# Altium project FlightController.PrjPcb (part 1 of 2)
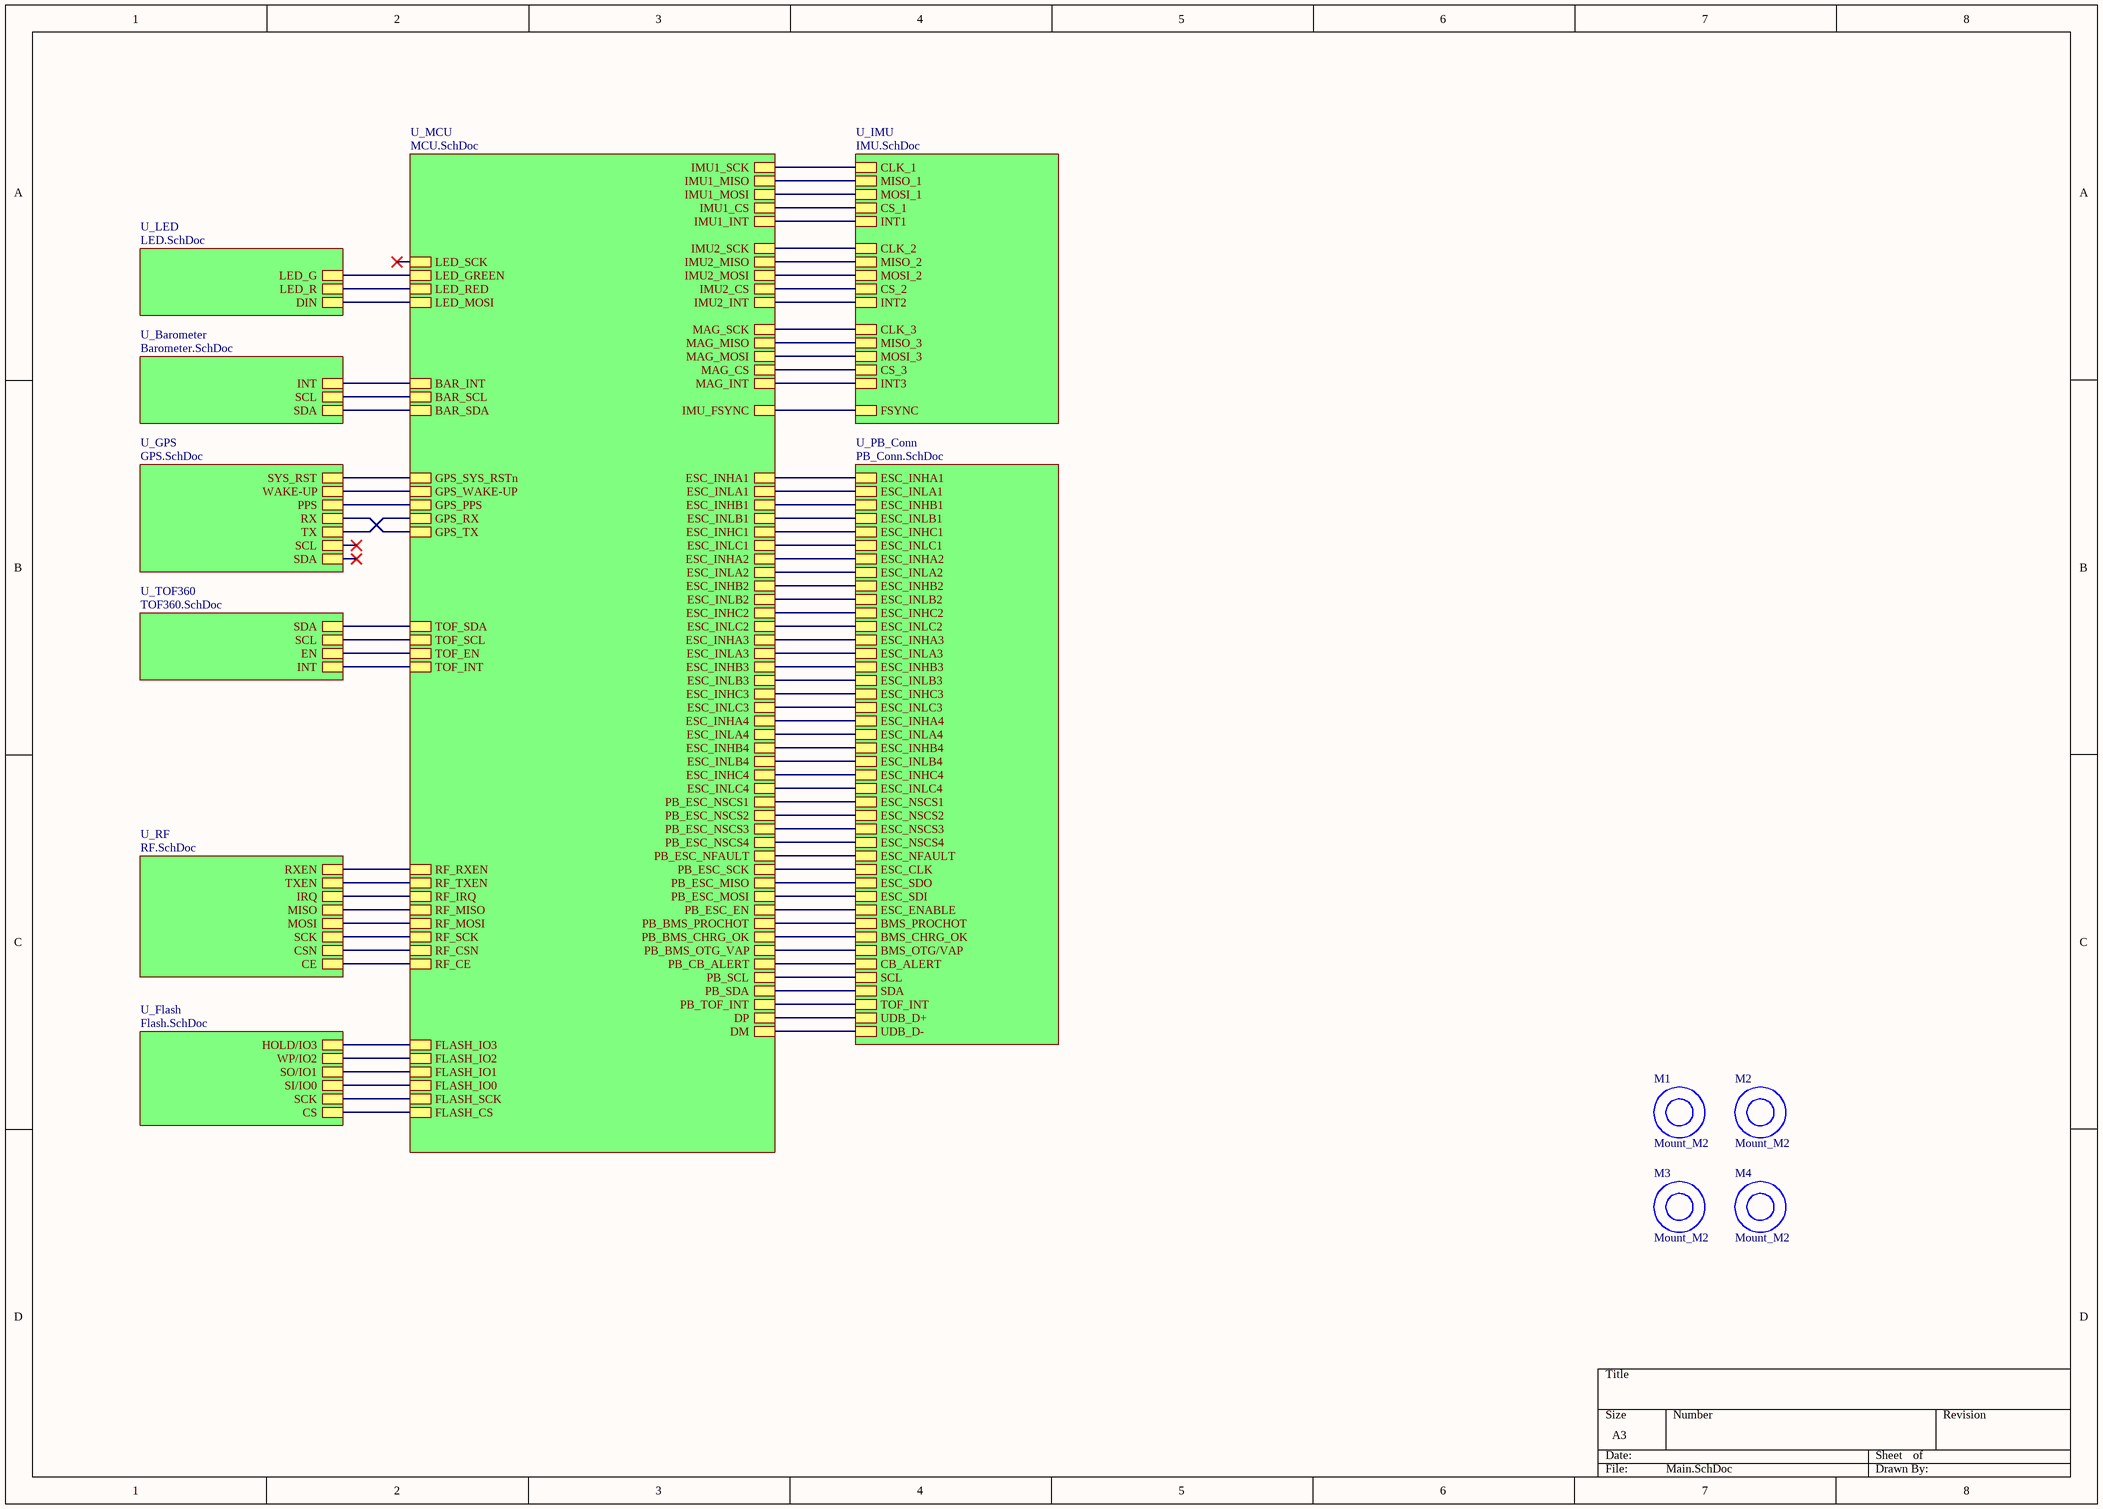
[diagram p0: Main.SchDoc]
12 sheets, 184 parts. Net scope: hierarchical (ports join the sheet entries above them; power ports are global).
Board file: PCB.PcbDoc
Sheets:
  Main.SchDoc
    U_MCU = MCU.SchDoc
    U_TOF360 = TOF360.SchDoc
    U_IMU = IMU.SchDoc
    U_RF = RF.SchDoc
      U_NRF24l01 = NRF24l01.SchDoc
    U_Flash = Flash.SchDoc
    U_GPS = GPS.SchDoc
    U_Barometer = Barometer.SchDoc
    U_LED = LED.SchDoc
    U_PB_Conn = PB_Conn.SchDoc
      U_PSU = PSU.SchDoc

## Sheet Main.SchDoc
size A3; SheetNumber: 1; SheetTotal: 12

### Parts
M1  Mount_M2  [Mount_M2]
M2  Mount_M2  [Mount_M2]
M3  Mount_M2  [Mount_M2]
M4  Mount_M2  [Mount_M2]

### Sub-sheets
U_Barometer = Barometer.SchDoc: SDA, SCL, INT
U_Flash = Flash.SchDoc: CS, SO/IO1, WP/IO2, HOLD/IO3, SCK, SI/IO0
U_GPS = GPS.SchDoc: SDA, SCL, TX, RX, PPS, WAKE-UP, SYS_RST
U_IMU = IMU.SchDoc: INT1, INT2, MISO_1, MOSI_1, CS_1, CLK_1, FSYNC, MISO_2, MOSI_2, CS_2, CLK_2, MOSI_3, CS_3, CLK_3, MISO_3, INT3
U_LED = LED.SchDoc: DIN, LED_R, LED_G
U_MCU = MCU.SchDoc: DP, DM, TOF_SDA, TOF_SCL, TOF_EN, TOF_INT, ESC_INHA1, ESC_INHA2, ESC_INHA3, ESC_INHA4, ESC_INHB1, ESC_INHC1, ESC_INHB2, ESC_INHB3, ESC_INHB4, ESC_INHC2, ESC_INHC3, ESC_INHC4, ESC_INLA1, ESC_INLB1, ESC_INLC1, ESC_INLA2, ESC_INLA3, ESC_INLA4, ESC_INLB2, ESC_INLB3, ESC_INLB4, ESC_INLC2, ESC_INLC3, ESC_INLC4, RF_IRQ, RF_CSN, RF_MOSI, RF_MISO, RF_SCK, RF_CE, RF_RXEN, RF_TXEN, PB_SCL, PB_SDA, PB_TOF_INT, PB_ESC_EN, PB_ESC_SCK, PB_ESC_MISO, PB_ESC_MOSI, PB_ESC_NSCS1, PB_ESC_NSCS2, PB_ESC_NSCS3, PB_ESC_NSCS4, PB_BMS_PROCHOT, PB_BMS_OTG_VAP, PB_BMS_CHRG_OK, PB_CB_ALERT, PB_ESC_NFAULT, FLASH_IO0, FLASH_IO1, FLASH_IO2, FLASH_IO3, FLASH_SCK, FLASH_CS, GPS_RX, GPS_TX, GPS_PPS, GPS_WAKE-UP, GPS_SYS_RSTn, BAR_SCL, BAR_SDA, BAR_INT, LED_MOSI, LED_SCK, LED_RED, LED_GREEN, IMU1_SCK, IMU1_MISO, IMU1_MOSI, IMU1_CS, IMU1_INT, IMU2_INT, IMU2_SCK, IMU2_MISO, IMU2_MOSI, IMU2_CS, MAG_SCK, MAG_MISO, MAG_MOSI, MAG_CS, MAG_INT, IMU_FSYNC
U_PB_Conn = PB_Conn.SchDoc: ESC_INLA1, ESC_INLB1, ESC_INLC1, ESC_INLA2, ESC_INLB2, ESC_INLC2, ESC_INLA3, ESC_INLB3, ESC_INLC3, ESC_INHA4, ESC_INLB4, ESC_INLC4, ESC_NSCS1, ESC_INHA1, ESC_INHB1, ESC_INHC1, ESC_INHA2, ESC_INHB2, ESC_INHC2, ESC_INHA3, ESC_INHB3, ESC_INHC3, ESC_INLA4, ESC_INHB4, ESC_INHC4, ESC_NSCS2, ESC_NSCS3, ESC_NSCS4, ESC_NFAULT, ESC_CLK, ESC_SDO, ESC_SDI, ESC_ENABLE, BMS_PROCHOT, BMS_CHRG_OK, BMS_OTG/VAP, CB_ALERT, SCL, SDA, TOF_INT, UDB_D+, UDB_D-
U_RF = RF.SchDoc: CE, CSN, SCK, MOSI, MISO, IRQ, TXEN, RXEN
U_TOF360 = TOF360.SchDoc: INT, SCL, SDA, EN

### Nets
BMS_CHRG_OK: sheet U_MCU/PB_BMS_CHRG_OK, sheet U_PB_Conn/BMS_CHRG_OK
BMS_OTG/VAP: sheet U_MCU/PB_BMS_OTG_VAP, sheet U_PB_Conn/BMS_OTG/VAP
BMS_PROCHOT: sheet U_MCU/PB_BMS_PROCHOT, sheet U_PB_Conn/BMS_PROCHOT
CB_ALERT: sheet U_MCU/PB_CB_ALERT, sheet U_PB_Conn/CB_ALERT
ESC_CLK: sheet U_MCU/PB_ESC_SCK, sheet U_PB_Conn/ESC_CLK
ESC_ENABLE: sheet U_MCU/PB_ESC_EN, sheet U_PB_Conn/ESC_ENABLE
ESC_INHA1: sheet U_MCU/ESC_INHA1, sheet U_PB_Conn/ESC_INHA1
ESC_INHA2: sheet U_MCU/ESC_INHA2, sheet U_PB_Conn/ESC_INHA2
ESC_INHA3: sheet U_MCU/ESC_INHA3, sheet U_PB_Conn/ESC_INHA3
ESC_INHA4: sheet U_MCU/ESC_INHA4, sheet U_PB_Conn/ESC_INHA4
ESC_INHB1: sheet U_MCU/ESC_INHB1, sheet U_PB_Conn/ESC_INHB1
ESC_INHB2: sheet U_MCU/ESC_INHB2, sheet U_PB_Conn/ESC_INHB2
ESC_INHB3: sheet U_MCU/ESC_INHB3, sheet U_PB_Conn/ESC_INHB3
ESC_INHB4: sheet U_MCU/ESC_INHB4, sheet U_PB_Conn/ESC_INHB4
ESC_INHC1: sheet U_MCU/ESC_INHC1, sheet U_PB_Conn/ESC_INHC1
ESC_INHC2: sheet U_MCU/ESC_INHC2, sheet U_PB_Conn/ESC_INHC2
ESC_INHC3: sheet U_MCU/ESC_INHC3, sheet U_PB_Conn/ESC_INHC3
ESC_INHC4: sheet U_MCU/ESC_INHC4, sheet U_PB_Conn/ESC_INHC4
ESC_INLA1: sheet U_MCU/ESC_INLA1, sheet U_PB_Conn/ESC_INLA1
ESC_INLA2: sheet U_MCU/ESC_INLA2, sheet U_PB_Conn/ESC_INLA2
ESC_INLA3: sheet U_MCU/ESC_INLA3, sheet U_PB_Conn/ESC_INLA3
ESC_INLA4: sheet U_MCU/ESC_INLA4, sheet U_PB_Conn/ESC_INLA4
ESC_INLB1: sheet U_MCU/ESC_INLB1, sheet U_PB_Conn/ESC_INLB1
ESC_INLB2: sheet U_MCU/ESC_INLB2, sheet U_PB_Conn/ESC_INLB2
ESC_INLB3: sheet U_MCU/ESC_INLB3, sheet U_PB_Conn/ESC_INLB3
ESC_INLB4: sheet U_MCU/ESC_INLB4, sheet U_PB_Conn/ESC_INLB4
ESC_INLC1: sheet U_MCU/ESC_INLC1, sheet U_PB_Conn/ESC_INLC1
ESC_INLC2: sheet U_MCU/ESC_INLC2, sheet U_PB_Conn/ESC_INLC2
ESC_INLC3: sheet U_MCU/ESC_INLC3, sheet U_PB_Conn/ESC_INLC3
ESC_INLC4: sheet U_MCU/ESC_INLC4, sheet U_PB_Conn/ESC_INLC4
ESC_NFAULT: sheet U_MCU/PB_ESC_NFAULT, sheet U_PB_Conn/ESC_NFAULT
ESC_NSCS1: sheet U_MCU/PB_ESC_NSCS1, sheet U_PB_Conn/ESC_NSCS1
ESC_NSCS2: sheet U_MCU/PB_ESC_NSCS2, sheet U_PB_Conn/ESC_NSCS2
ESC_NSCS3: sheet U_MCU/PB_ESC_NSCS3, sheet U_PB_Conn/ESC_NSCS3
ESC_NSCS4: sheet U_MCU/PB_ESC_NSCS4, sheet U_PB_Conn/ESC_NSCS4
ESC_SDI: sheet U_MCU/PB_ESC_MOSI, sheet U_PB_Conn/ESC_SDI
ESC_SDO: sheet U_MCU/PB_ESC_MISO, sheet U_PB_Conn/ESC_SDO
I2C1_SCL: sheet U_MCU/TOF_SCL, sheet U_TOF360/SCL
I2C1_SDA: sheet U_MCU/TOF_SDA, sheet U_TOF360/SDA
SCL: sheet U_MCU/PB_SCL, sheet U_PB_Conn/SCL
SDA: sheet U_MCU/PB_SDA, sheet U_PB_Conn/SDA
SPI1_MISO: sheet U_MCU/IMU1_MISO, sheet U_IMU/MISO_1
SPI1_MOSI: sheet U_MCU/IMU1_MOSI, sheet U_IMU/MOSI_1
SPI1_SCK: sheet U_MCU/IMU1_SCK, sheet U_IMU/CLK_1
SPI5_MISO: sheet U_MCU/MAG_MISO, sheet U_IMU/MISO_3
SPI5_MOSI: sheet U_MCU/MAG_MOSI, sheet U_IMU/MOSI_3
SPI5_SCK: sheet U_MCU/MAG_SCK, sheet U_IMU/CLK_3
SPI6_MISO: sheet U_MCU/IMU2_MISO, sheet U_IMU/MISO_2
SPI6_MOSI: sheet U_MCU/IMU2_MOSI, sheet U_IMU/MOSI_2
SPI6_SCK: sheet U_MCU/IMU2_SCK, sheet U_IMU/CLK_2
TOF_EN: sheet U_MCU/TOF_EN, sheet U_TOF360/EN
TOF_INT: sheet U_MCU/PB_TOF_INT, sheet U_PB_Conn/TOF_INT
TOF_INT: sheet U_MCU/TOF_INT, sheet U_TOF360/INT  [a separate net that carries the same name]
UDB_D+: sheet U_MCU/DP, sheet U_PB_Conn/UDB_D+
UDB_D-: sheet U_MCU/DM, sheet U_PB_Conn/UDB_D-
NetC86_2: sheet U_MCU/GPS_TX, sheet U_GPS/RX
NetC87_2: sheet U_MCU/GPS_RX, sheet U_GPS/TX
NetC88_2: sheet U_MCU/GPS_PPS, sheet U_GPS/PPS
NetIC1_5: sheet U_MCU/IMU1_CS, sheet U_IMU/CS_1
NetIC1_6: sheet U_MCU/IMU1_INT, sheet U_IMU/INT1
NetIC1_8: sheet U_MCU/IMU_FSYNC, sheet U_IMU/FSYNC
NetIC2_4: sheet U_MCU/IMU2_INT, sheet U_IMU/INT2
NetIC2_12: sheet U_MCU/IMU2_CS, sheet U_IMU/CS_2
NetIC3_1: sheet U_MCU/MAG_INT, sheet U_IMU/INT3
NetIC3_2: sheet U_MCU/MAG_CS, sheet U_IMU/CS_3
NetIC4_5: sheet U_MCU/LED_MOSI, sheet U_LED/DIN
NetIC4_26: sheet U_MCU/LED_GREEN, sheet U_LED/LED_G
NetIC4_27: sheet U_MCU/LED_RED, sheet U_LED/LED_R
NetIC4_42: sheet U_MCU/FLASH_IO3, sheet U_Flash/HOLD/IO3
NetIC4_43: sheet U_MCU/FLASH_IO2, sheet U_Flash/WP/IO2
NetIC4_46: sheet U_MCU/FLASH_IO1, sheet U_Flash/SO/IO1
NetIC4_47: sheet U_MCU/FLASH_IO0, sheet U_Flash/SI/IO0
NetIC4_48: sheet U_MCU/FLASH_SCK, sheet U_Flash/SCK
NetIC4_53: sheet U_MCU/BAR_INT, sheet U_Barometer/INT
NetIC4_54: sheet U_MCU/BAR_SCL, sheet U_Barometer/SCL
NetIC4_55: sheet U_MCU/BAR_SDA, sheet U_Barometer/SDA
NetIC4_64: sheet U_MCU/FLASH_CS, sheet U_Flash/CS
NetIC4_91: sheet U_MCU/GPS_SYS_RSTn, sheet U_GPS/SYS_RST
NetIC4_100: sheet U_MCU/GPS_WAKE-UP, sheet U_GPS/WAKE-UP
NetIC4_110: sheet U_MCU/RF_CE, sheet U_RF/CE
NetIC4_111: sheet U_MCU/RF_SCK, sheet U_RF/SCK
NetIC4_112: sheet U_MCU/RF_MISO, sheet U_RF/MISO
NetIC4_113: sheet U_MCU/RF_MOSI, sheet U_RF/MOSI
NetIC4_114: sheet U_MCU/RF_CSN, sheet U_RF/CSN
NetIC4_115: sheet U_MCU/RF_IRQ, sheet U_RF/IRQ
NetIC4_116: sheet U_MCU/RF_TXEN, sheet U_RF/TXEN
NetIC4_117: sheet U_MCU/RF_RXEN, sheet U_RF/RXEN

## Sheet MCU.SchDoc
size A2; SheetNumber: 3; SheetTotal: 12
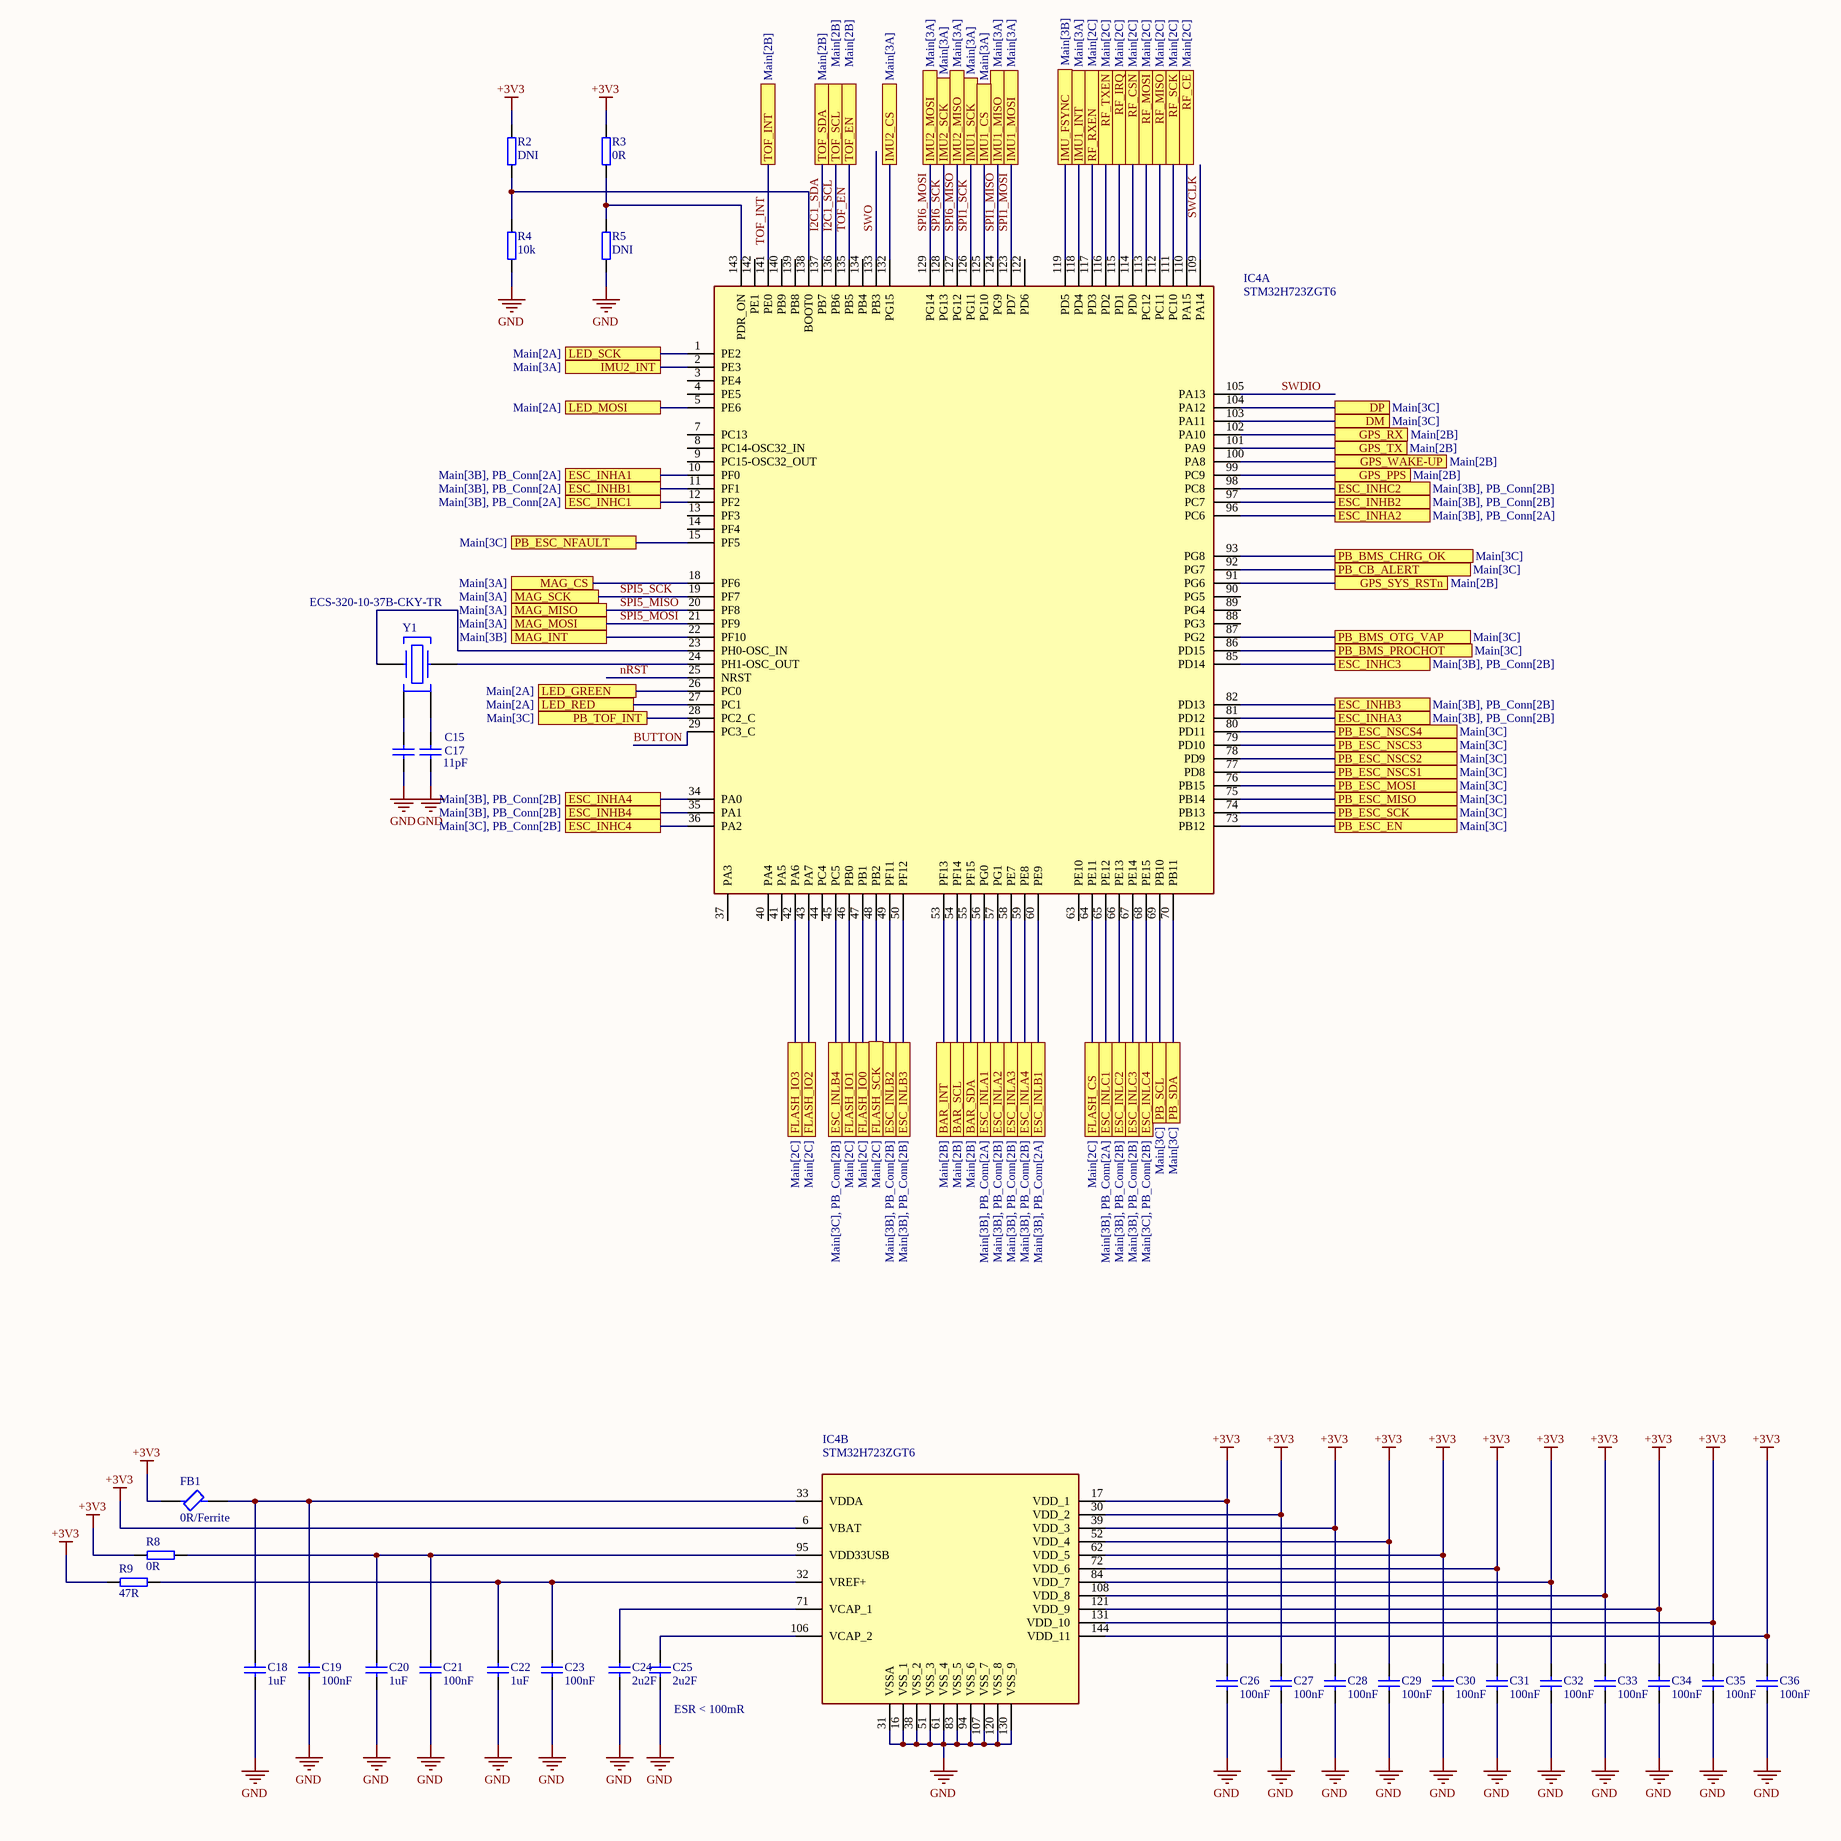
[diagram p1: MCU.SchDoc, left]
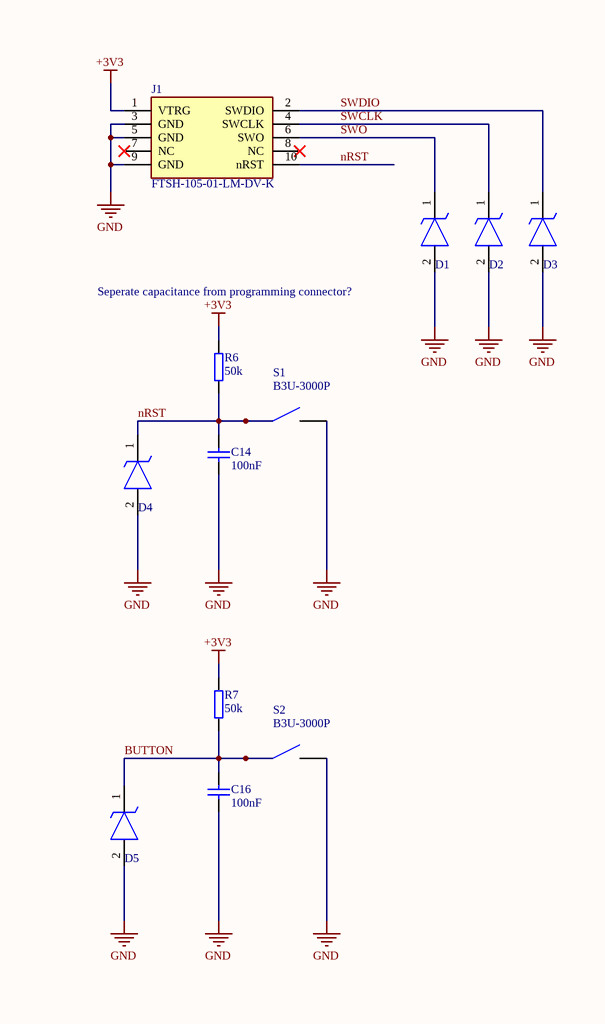
[diagram p2: MCU.SchDoc, right]

### Parts
C14  value 100nF  [CAP0402]  (hidden comment: Cap0402)
C15  Cap0402  [CAP0402]  (value not drawn)
C16  value 100nF  [CAP0402]  (hidden comment: Cap0402)
C17  value 11pF  [CAP0402]  (hidden comment: Cap0402)
C18  value 1uF  [CAP0603]  (hidden comment: Cap0603)
C19  value 100nF  [CAP0402]  (hidden comment: Cap0402)
C20  value 1uF  [CAP0603]  (hidden comment: Cap0603)
C21  value 100nF  [CAP0402]  (hidden comment: Cap0402)
C22  value 1uF  [CAP0603]  (hidden comment: Cap0603)
C23  value 100nF  [CAP0402]  (hidden comment: Cap0402)
C24  value 2u2F  [CAP0603]  (hidden comment: Cap0603)
C25  value 2u2F  [CAP0603]  (hidden comment: Cap0603)
C26  value 100nF  [CAP0402]  (hidden comment: Cap0402)
C27  value 100nF  [CAP0402]  (hidden comment: Cap0402)
C28  value 100nF  [CAP0402]  (hidden comment: Cap0402)
C29  value 100nF  [CAP0402]  (hidden comment: Cap0402)
C30  value 100nF  [CAP0402]  (hidden comment: Cap0402)
C31  value 100nF  [CAP0402]  (hidden comment: Cap0402)
C32  value 100nF  [CAP0402]  (hidden comment: Cap0402)
C33  value 100nF  [CAP0402]  (hidden comment: Cap0402)
C34  value 100nF  [CAP0402]  (hidden comment: Cap0402)
C35  value 100nF  [CAP0402]  (hidden comment: Cap0402)
C36  value 100nF  [CAP0402]  (hidden comment: Cap0402)
D1  D1213A-01LP4-7B  [D1213A01LP47B]  (value not drawn)
D2  D1213A-01LP4-7B  [D1213A01LP47B]  (value not drawn)
D3  D1213A-01LP4-7B  [D1213A01LP47B]  (value not drawn)
D4  D1213A-01LP4-7B  [D1213A01LP47B]  (value not drawn)
D5  D1213A-01LP4-7B  [D1213A01LP47B]  (value not drawn)
FB1  0R/Ferrite  [NFZ15SG152SN10B]
IC4  STM32H723ZGT6  [QFP50P2200X2200X160-144N]  (parts A,B of 2)
J1  FTSH-105-01-LM-DV-K  [FTSH-105-XX-YYY-DV-K]
R2  value DNI  [RES0402]  (hidden comment: Res0402)
R3  value 0R  [RES0402]  (hidden comment: Res0402)
R4  value 10k  [RES0402]  (hidden comment: Res0402)
R5  value DNI  [RES0402]  (hidden comment: Res0402)
R6  value 50k  [RES0402]  (hidden comment: Res0402)
R7  value 50k  [RES0402]  (hidden comment: Res0402)
R8  value 0R  [RES0402]  (hidden comment: Res0402)
R9  value 47R  [RES0402]  (hidden comment: Res0402)
S1  B3U-3000P  [B3U-1000P]
S2  B3U-3000P  [B3U-1000P]
Y1  ECS-320-10-37B-CKY-TR  [ECS3201037BCKYTR]

### Ports
BAR_INT (see Main[2B]), BAR_SCL (see Main[2B]), BAR_SDA (see Main[2B]), DM (see Main[3C]), DP (see Main[3C]), ESC_INHA1 (see Main[3B], PB_Conn[2A]), ESC_INHA2 (see Main[3B], PB_Conn[2A]), ESC_INHA3 (see Main[3B], PB_Conn[2B]), ESC_INHA4 (see Main[3B], PB_Conn[2B]), ESC_INHB1 (see Main[3B], PB_Conn[2A]), ESC_INHB2 (see Main[3B], PB_Conn[2B]), ESC_INHB3 (see Main[3B], PB_Conn[2B]), ESC_INHB4 (see Main[3B], PB_Conn[2B]), ESC_INHC1 (see Main[3B], PB_Conn[2A]), ESC_INHC2 (see Main[3B], PB_Conn[2B]), ESC_INHC3 (see Main[3B], PB_Conn[2B]), ESC_INHC4 (see Main[3C], PB_Conn[2B]), ESC_INLA1 (see Main[3B], PB_Conn[2A]), ESC_INLA2 (see Main[3B], PB_Conn[2B]), ESC_INLA3 (see Main[3B], PB_Conn[2B]), ESC_INLA4 (see Main[3B], PB_Conn[2B]), ESC_INLB1 (see Main[3B], PB_Conn[2A]), ESC_INLB2 (see Main[3B], PB_Conn[2B]), ESC_INLB3 (see Main[3B], PB_Conn[2B]), ESC_INLB4 (see Main[3C], PB_Conn[2B]), ESC_INLC1 (see Main[3B], PB_Conn[2A]), ESC_INLC2 (see Main[3B], PB_Conn[2B]), ESC_INLC3 (see Main[3B], PB_Conn[2B]), ESC_INLC4 (see Main[3C], PB_Conn[2B]), FLASH_CS (see Main[2C]), FLASH_IO0 (see Main[2C]), FLASH_IO1 (see Main[2C]), FLASH_IO2 (see Main[2C]), FLASH_IO3 (see Main[2C]), FLASH_SCK (see Main[2C]), GPS_PPS (see Main[2B]), GPS_RX (see Main[2B]), GPS_SYS_RSTn (see Main[2B]), GPS_TX (see Main[2B]), GPS_WAKE-UP (see Main[2B]), IMU1_CS (see Main[3A]), IMU1_INT (see Main[3A]), IMU1_MISO (see Main[3A]), IMU1_MOSI (see Main[3A]), IMU1_SCK (see Main[3A]), IMU2_CS (see Main[3A]), IMU2_INT (see Main[3A]), IMU2_MISO (see Main[3A]), IMU2_MOSI (see Main[3A]), IMU2_SCK (see Main[3A]), IMU_FSYNC (see Main[3B]), LED_GREEN (see Main[2A]), LED_MOSI (see Main[2A]), LED_RED (see Main[2A]), LED_SCK (see Main[2A]), MAG_CS (see Main[3A]), MAG_INT (see Main[3B]), MAG_MISO (see Main[3A]), MAG_MOSI (see Main[3A]), MAG_SCK (see Main[3A]), PB_BMS_CHRG_OK (see Main[3C]), PB_BMS_OTG_VAP (see Main[3C]), PB_BMS_PROCHOT (see Main[3C]), PB_CB_ALERT (see Main[3C]), PB_ESC_EN (see Main[3C]), PB_ESC_MISO (see Main[3C]), PB_ESC_MOSI (see Main[3C]), PB_ESC_NFAULT (see Main[3C]), PB_ESC_NSCS1 (see Main[3C]), PB_ESC_NSCS2 (see Main[3C]), PB_ESC_NSCS3 (see Main[3C]), PB_ESC_NSCS4 (see Main[3C]), PB_ESC_SCK (see Main[3C]), PB_SCL (see Main[3C]), PB_SDA (see Main[3C]), PB_TOF_INT (see Main[3C]), RF_CE (see Main[2C]), RF_CSN (see Main[2C]), RF_IRQ (see Main[2C]), RF_MISO (see Main[2C]), RF_MOSI (see Main[2C]), RF_RXEN (see Main[2C]), RF_SCK (see Main[2C]), RF_TXEN (see Main[2C]), TOF_EN (see Main[2B]), TOF_INT (see Main[2B]), TOF_SCL (see Main[2B]), TOF_SDA (see Main[2B])

### Nets
+3V3: C26.2 C27.2 C28.2 C29.2 C30.2 C31.2 C32.2 C33.2 C34.2 C35.2 C36.2 FB1.1 IC4.6(VBAT) IC4.17(VDD_1) IC4.30(VDD_2) IC4.39(VDD_3) IC4.52(VDD_4) IC4.62(VDD_5) IC4.72(VDD_6) IC4.84(VDD_7) IC4.108(VDD_8) IC4.121(VDD_9) IC4.131(VDD_10) IC4.144(VDD_11) J1.1(VTRG) R2.2 R3.2 R6.2 R7.2 R8.1 R9.1
GND: C14.1 C15.1 C16.1 C17.1 C18.1 C19.1 C20.1 C21.1 C22.1 C23.1 C24.1 C25.1 C26.1 C27.1 C28.1 C29.1 C30.1 C31.1 C32.1 C33.1 C34.1 C35.1 C36.1 D1.2(A) D2.2(A) D3.2(A) D4.2(A) D5.2(A) IC4.16(VSS_1) IC4.31(VSSA) IC4.38(VSS_2) IC4.51(VSS_3) IC4.61(VSS_4) IC4.83(VSS_5) IC4.94(VSS_6) IC4.107(VSS_7) IC4.120(VSS_8) IC4.130(VSS_9) J1.3(GND) J1.5(GND) J1.9(GND) R4.1 R5.1 S1.1 S2.1
BMS_CHRG_OK: IC4.93(PG8) ; port PB_BMS_CHRG_OK
BMS_OTG/VAP: IC4.87(PG2) ; port PB_BMS_OTG_VAP
BMS_PROCHOT: IC4.86(PD15) ; port PB_BMS_PROCHOT
BUTTON: C16.2 D5.1(K) IC4.29(PC3_C) R7.1 S2.2
CB_ALERT: IC4.92(PG7) ; port PB_CB_ALERT
ESC_CLK: IC4.74(PB13) ; port PB_ESC_SCK
ESC_ENABLE: IC4.73(PB12) ; port PB_ESC_EN
ESC_INHA1: IC4.10(PF0) ; port ESC_INHA1
ESC_INHA2: IC4.96(PC6) ; port ESC_INHA2
ESC_INHA3: IC4.81(PD12) ; port ESC_INHA3
ESC_INHA4: IC4.34(PA0) ; port ESC_INHA4
ESC_INHB1: IC4.11(PF1) ; port ESC_INHB1
ESC_INHB2: IC4.97(PC7) ; port ESC_INHB2
ESC_INHB3: IC4.82(PD13) ; port ESC_INHB3
ESC_INHB4: IC4.35(PA1) ; port ESC_INHB4
ESC_INHC1: IC4.12(PF2) ; port ESC_INHC1
ESC_INHC2: IC4.98(PC8) ; port ESC_INHC2
ESC_INHC3: IC4.85(PD14) ; port ESC_INHC3
ESC_INHC4: IC4.36(PA2) ; port ESC_INHC4
ESC_INLA1: IC4.56(PG0) ; port ESC_INLA1
ESC_INLA2: IC4.57(PG1) ; port ESC_INLA2
ESC_INLA3: IC4.58(PE7) ; port ESC_INLA3
ESC_INLA4: IC4.59(PE8) ; port ESC_INLA4
ESC_INLB1: IC4.60(PE9) ; port ESC_INLB1
ESC_INLB2: IC4.49(PF11) ; port ESC_INLB2
ESC_INLB3: IC4.50(PF12) ; port ESC_INLB3
ESC_INLB4: IC4.45(PC5) ; port ESC_INLB4
ESC_INLC1: IC4.65(PE12) ; port ESC_INLC1
ESC_INLC2: IC4.66(PE13) ; port ESC_INLC2
ESC_INLC3: IC4.67(PE14) ; port ESC_INLC3
ESC_INLC4: IC4.68(PE15) ; port ESC_INLC4
ESC_NFAULT: IC4.15(PF5) ; port PB_ESC_NFAULT
ESC_NSCS1: IC4.77(PD8) ; port PB_ESC_NSCS1
ESC_NSCS2: IC4.78(PD9) ; port PB_ESC_NSCS2
ESC_NSCS3: IC4.79(PD10) ; port PB_ESC_NSCS3
ESC_NSCS4: IC4.80(PD11) ; port PB_ESC_NSCS4
ESC_SDI: IC4.76(PB15) ; port PB_ESC_MOSI
ESC_SDO: IC4.75(PB14) ; port PB_ESC_MISO
I2C1_SCL: IC4.136(PB6) ; port TOF_SCL
I2C1_SDA: IC4.137(PB7) ; port TOF_SDA
nRST: C14.2 D4.1(K) IC4.25(NRST) J1.10(nRST) R6.1 S1.2
SCL: IC4.69(PB10) ; port PB_SCL
SDA: IC4.70(PB11) ; port PB_SDA
SPI1_MISO: IC4.124(PG9) ; port IMU1_MISO
SPI1_MOSI: IC4.123(PD7) ; port IMU1_MOSI
SPI1_SCK: IC4.126(PG11) ; port IMU1_SCK
SPI5_MISO: IC4.20(PF8) ; port MAG_MISO
SPI5_MOSI: IC4.21(PF9) ; port MAG_MOSI
SPI5_SCK: IC4.19(PF7) ; port MAG_SCK
SPI6_MISO: IC4.127(PG12) ; port IMU2_MISO
SPI6_MOSI: IC4.129(PG14) ; port IMU2_MOSI
SPI6_SCK: IC4.128(PG13) ; port IMU2_SCK
SWCLK: D2.1(K) IC4.109(PA14) J1.4(SWCLK)
SWDIO: D3.1(K) IC4.105(PA13) J1.2(SWDIO)
SWO: D1.1(K) IC4.133(PB3) J1.6(SWO)
TOF_EN: IC4.135(PB5) ; port TOF_EN
TOF_INT: IC4.28(PC2_C) ; port PB_TOF_INT
TOF_INT: IC4.141(PE0) ; port TOF_INT  [a separate net that carries the same name]
UDB_D+: IC4.104(PA12) ; port DP
UDB_D-: IC4.103(PA11) ; port DM
NetC15_2: C15.2 Y1.4(GND_2)
NetC17_2: C17.2 Y1.2(GND_1)
NetC18_2: C18.2 C19.2 FB1.2 IC4.33(VDDA)
NetC20_2: C20.2 C21.2 IC4.95(VDD33USB) R8.2
NetC22_2: C22.2 C23.2 IC4.32(VREF+) R9.2
NetC24_2: C24.2 IC4.71(VCAP_1)
NetC25_2: C25.2 IC4.106(VCAP_2)
NetC86_2: IC4.101(PA9) ; port GPS_TX
NetC87_2: IC4.102(PA10) ; port GPS_RX
NetC88_2: IC4.99(PC9) ; port GPS_PPS
NetIC1_5: IC4.125(PG10) ; port IMU1_CS
NetIC1_6: IC4.118(PD4) ; port IMU1_INT
NetIC1_8: IC4.119(PD5) ; port IMU_FSYNC
NetIC2_4: IC4.2(PE3) ; port IMU2_INT
NetIC2_12: IC4.132(PG15) ; port IMU2_CS
NetIC3_1: IC4.22(PF10) ; port MAG_INT
NetIC3_2: IC4.18(PF6) ; port MAG_CS
NetIC4_1: IC4.1(PE2) ; port LED_SCK
NetIC4_5: IC4.5(PE6) ; port LED_MOSI
NetIC4_23: IC4.23(PH0-OSC_IN) Y1.1(CRYSTAL_1)
NetIC4_24: IC4.24(PH1-OSC_OUT) Y1.3(CRYSTAL_2)
NetIC4_26: IC4.26(PC0) ; port LED_GREEN
NetIC4_27: IC4.27(PC1) ; port LED_RED
NetIC4_42: IC4.42(PA6) ; port FLASH_IO3
NetIC4_43: IC4.43(PA7) ; port FLASH_IO2
NetIC4_46: IC4.46(PB0) ; port FLASH_IO1
NetIC4_47: IC4.47(PB1) ; port FLASH_IO0
NetIC4_48: IC4.48(PB2) ; port FLASH_SCK
NetIC4_53: IC4.53(PF13) ; port BAR_INT
NetIC4_54: IC4.54(PF14) ; port BAR_SCL
NetIC4_55: IC4.55(PF15) ; port BAR_SDA
NetIC4_64: IC4.64(PE11) ; port FLASH_CS
NetIC4_91: IC4.91(PG6) ; port GPS_SYS_RSTn
NetIC4_100: IC4.100(PA8) ; port GPS_WAKE-UP
NetIC4_110: IC4.110(PA15) ; port RF_CE
NetIC4_111: IC4.111(PC10) ; port RF_SCK
NetIC4_112: IC4.112(PC11) ; port RF_MISO
NetIC4_113: IC4.113(PC12) ; port RF_MOSI
NetIC4_114: IC4.114(PD0) ; port RF_CSN
NetIC4_115: IC4.115(PD1) ; port RF_IRQ
NetIC4_116: IC4.116(PD2) ; port RF_TXEN
NetIC4_117: IC4.117(PD3) ; port RF_RXEN
NetIC4_138: IC4.138(BOOT0) R2.1 R4.2
NetIC4_143: IC4.143(PDR_ON) R3.1 R5.2

Not connected (* = marked no-connect by the designer): IC4 3(PE4) 4(PE5) 7(PC13) 8(PC14-OSC32_IN) 9(PC15-OSC32_OUT) 13(PF3) 14(PF4) 37(PA3) 40(PA4) 41(PA5) 44(PC4) 63(PE10) 88(PG3) 89(PG4) 90(PG5) 122(PD6) 134(PB4) 139(PB8) 140(PB9) 142(PE1); J1 7(NC)* 8(NC)*

### Notes on the sheet
- Seperate capacitance from programming connector?
- (near C25) ESR < 100mR

### Library data of the parts
C14 C16 C17 C19 C21 C23 C26-C36 = Cap0402: Voltage: 50V
C15 = Cap0402: Voltage: 50V; Value: 11pF
C18 C20 C22 C24 C25 = Cap0603: Voltage: 50V
D1-D5 = D1213A-01LP4-7B: TVS Diode (Uni-directional); Manufacturer_Name: Diodes Incorporated; Datasheet Link: https://www.diodes.com/assets/Datasheets/D1213A-01LP4.pdf; Height: 0.4mm; Manufacturer_Part_Number: D1213A-01LP4-7B; Mouser Part Number: 621-D1213A-01LP4-7B; Mouser Price/Stock: https://www.mouser.co.uk/ProductDetail/Diodes-Incorporated/D1213A-01LP4-7B?qs=gfe7vQ8txpVKfG5NOSOvfA%3D%3D; Arrow Part Number: D1213A-01LP4-7B; Arrow Price/Stock: https://www.arrow.com/en/products/d1213a-01lp4-7b/diodes-incorporated?region=europe
FB1 = BLM15PE471SH1D: Ferrite Bead; Manufacturer_Name: Murata Electronics; Datasheet Link: https://www.murata.com/en-global/products/productdetail.aspx?cate=luNoiseSupprFilteChipFerriBead&partno=BLM15PE471SH1%23; Height: 0.55mm; Manufacturer_Part_Number: BLM15PE471SH1D; Mouser Part Number: 81-BLM15PE471SH1D; Mouser Price/Stock: https://www.mouser.co.uk/ProductDetail/Murata-Electronics/BLM15PE471SH1D?qs=DRkmTr78QATAY5qAVx1hGA%3D%3D
IC4 = STM32H723ZGT6: Integrated Circuit; Manufacturer_Name: STMicroelectronics; Datasheet Link: https://www.mouser.cn/datasheet/2/389/stm32h723zg-1893346.pdf; Height: 1.6mm; Manufacturer_Part_Number: STM32H723ZGT6; Mouser Part Number: 511-STM32H723ZGT6; Mouser Price/Stock: https://www.mouser.co.uk/ProductDetail/STMicroelectronics/STM32H723ZGT6?qs=sPbYRqrBIVkPaOxQT7wG%252BA%3D%3D; Arrow Part Number: STM32H723ZGT6; Arrow Price/Stock: https://www.arrow.com/en/products/stm32h723zgt6/stmicroelectronics?region=nac
J1 = FTSH-105-01-LM-DV-K: Connector; Manufacturer_Name: SAMTEC; Datasheet Link: http://suddendocs.samtec.com/prints/ftsh-1xx-xx-xxx-dv-xxx-xxx-mkt.pdf; Manufacturer_Part_Number: FTSH-105-01-LM-DV-K; Mouser Part Number: 200-FTSH10501LMDVK; Mouser Price/Stock: https://www.mouser.co.uk/ProductDetail/Samtec/FTSH-105-01-LM-DV-K?qs=Cqqh%252BS766wkgt1n7b4Yb6g%3D%3D; Arrow Part Number: FTSH-105-01-LM-DV-K; Arrow Price/Stock: https://www.arrow.com/en/products/ftsh-105-01-lm-dv-k/samtec?utm_currency=USD&region=nac
S1 S2 = B3U-3000P: Switch; Manufacturer_Name: Omron Electronics; Datasheet Link: http://omronfs.omron.com/en_US/ecb/products/pdf/en-b3u.pdf; Manufacturer_Part_Number: B3U-3000P; Mouser Part Number: 653-B3U-3000P; Mouser Price/Stock: https://www.mouser.co.uk/ProductDetail/Omron-Electronics/B3U-3000P?qs=AO7BQMcsEu4un9I7hS23xg%3D%3D; Arrow Part Number: B3U-3000P; Arrow Price/Stock: https://www.arrow.com/en/products/b3u-3000p/omron?region=nac
Y1 = ECS-320-10-37B-CKY-TR: Crystal or Oscillator; Manufacturer_Name: ECS; Datasheet Link: https://ecsxtal.com/store/pdf/ECX-1637B.pdf; Height: 0.5mm; Manufacturer_Part_Number: ECS-320-10-37B-CKY-TR; Mouser Part Number: 520-320-10-37B-CKYT; Mouser Price/Stock: https://www.mouser.co.uk/ProductDetail/ECS/ECS-320-10-37B-CKY-TR?qs=l7cgNqFNU1gltxVt%2FwcX%252Bw%3D%3D; Arrow Part Number: ECS-320-10-37B-CKY-TR; Arrow Price/Stock: https://www.arrow.com/en/products/ecs-320-10-37b-cky-tr/ecs-international?region=nac

## Sheet TOF360.SchDoc
size 482 x 241 mm; SheetNumber: 6; SheetTotal: 12
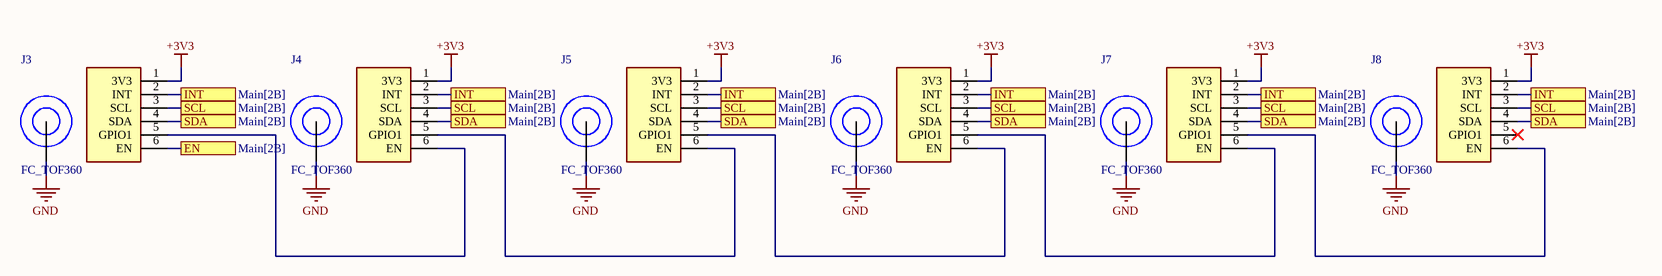
[diagram p3: TOF360.SchDoc]

### Parts
J3  FC_TOF360  [TOF_Mount]
J4  FC_TOF360  [TOF_Mount]
J5  FC_TOF360  [TOF_Mount]
J6  FC_TOF360  [TOF_Mount]
J7  FC_TOF360  [TOF_Mount]
J8  FC_TOF360  [TOF_Mount]

### Ports
EN (see Main[2B]), INT (see Main[2B]), SCL (see Main[2B]), SDA (see Main[2B])

### Nets
+3V3: J3.1(3V3) J4.1(3V3) J5.1(3V3) J6.1(3V3) J7.1(3V3) J8.1(3V3)
GND: J3.7 J4.7 J5.7 J6.7 J7.7 J8.7
I2C1_SCL: J3.3(SCL) J4.3(SCL) J5.3(SCL) J6.3(SCL) J7.3(SCL) J8.3(SCL) ; port SCL
I2C1_SDA: J3.4(SDA) J4.4(SDA) J5.4(SDA) J6.4(SDA) J7.4(SDA) J8.4(SDA) ; port SDA
TOF_EN: J3.6(EN) ; port EN
TOF_INT: J3.2(INT) J4.2(INT) J5.2(INT) J6.2(INT) J7.2(INT) J8.2(INT) ; port INT
NetJ3_5: J3.5(GPIO1) J4.6(EN)
NetJ4_5: J4.5(GPIO1) J5.6(EN)
NetJ5_5: J5.5(GPIO1) J6.6(EN)
NetJ6_5: J6.5(GPIO1) J7.6(EN)
NetJ7_5: J7.5(GPIO1) J8.6(EN)

Not connected (* = marked no-connect by the designer): J8 5(GPIO1)*

## Sheet IMU.SchDoc
size A2 portrait; SheetNumber: 3; SheetTotal: 11
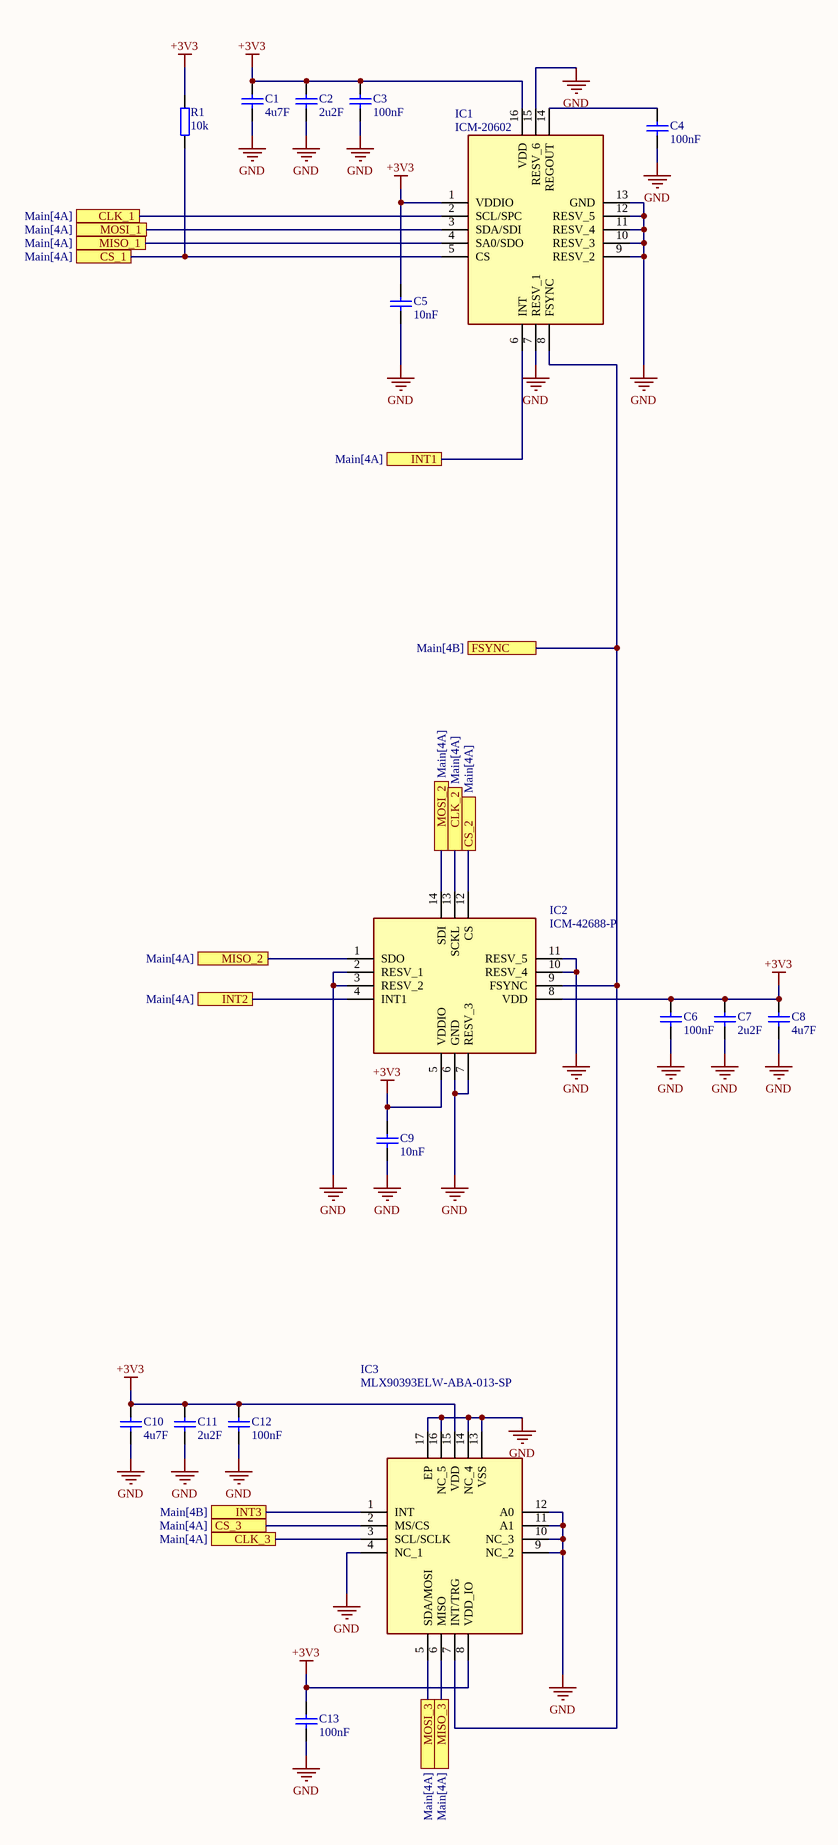
[diagram p4: IMU.SchDoc]

### Parts
C1  value 4u7F  [CAP0805]  (hidden comment: Cap0805)
C2  value 2u2F  [CAP0603]  (hidden comment: Cap0603)
C3  value 100nF  [CAP0402]  (hidden comment: Cap0402)
C4  value 100nF  [CAP0402]  (hidden comment: Cap0402)
C5  value 10nF  [CAP0402]  (hidden comment: Cap0402)
C6  value 100nF  [CAP0402]  (hidden comment: Cap0402)
C7  value 2u2F  [CAP0603]  (hidden comment: Cap0603)
C8  value 4u7F  [CAP0805]  (hidden comment: Cap0805)
C9  value 10nF  [CAP0402]  (hidden comment: Cap0402)
C10  value 4u7F  [CAP0805]  (hidden comment: Cap0805)
C11  value 2u2F  [CAP0603]  (hidden comment: Cap0603)
C12  value 100nF  [CAP0402]  (hidden comment: Cap0402)
C13  value 100nF  [CAP0402]  (hidden comment: Cap0402)
IC1  ICM-20602  [IAM20680HP]
IC2  ICM-42688-P  [IIM42352]
IC3  MLX90393ELW-ABA-013-SP  [QFN50P300X300X100-17N-D]
R1  value 10k  [RES0402]  (hidden comment: Res0402)

### Ports
CLK_1 (see Main[4A]), CLK_2 (see Main[4A]), CLK_3 (see Main[4A]), CS_1 (see Main[4A]), CS_2 (see Main[4A]), CS_3 (see Main[4A]), FSYNC (see Main[4B]), INT1 (see Main[4A]), INT2 (see Main[4A]), INT3 (see Main[4B]), MISO_1 (see Main[4A]), MISO_2 (see Main[4A]), MISO_3 (see Main[4A]), MOSI_1 (see Main[4A]), MOSI_2 (see Main[4A]), MOSI_3 (see Main[4A])

### Nets
+3V3: C1.2 C2.2 C3.2 C5.2 C6.2 C7.2 C8.2 C9.2 C10.2 C11.2 C12.2 C13.2 IC1.1(VDDIO) IC1.16(VDD) IC2.5(VDDIO) IC2.8(VDD) IC3.8(VDD_IO) IC3.15(VDD) R1.2
GND: C1.1 C2.1 C3.1 C4.1 C5.1 C6.1 C7.1 C8.1 C9.1 C10.1 C11.1 C12.1 C13.1 IC1.7(RESV_1) IC1.9(RESV_2) IC1.10(RESV_3) IC1.11(RESV_4) IC1.12(RESV_5) IC1.13(GND) IC1.15(RESV_6) IC2.2(RESV_1) IC2.3(RESV_2) IC2.6(GND) IC2.7(RESV_3) IC2.10(RESV_4) IC2.11(RESV_5) IC3.4(NC_1) IC3.9(NC_2) IC3.10(NC_3) IC3.11(A1) IC3.12(A0) IC3.13(VSS) IC3.14(NC_4) IC3.16(NC_5) IC3.17(EP)
SPI1_MISO: IC1.4(SA0/SDO) ; port MISO_1
SPI1_MOSI: IC1.3(SDA/SDI) ; port MOSI_1
SPI1_SCK: IC1.2(SCL/SPC) ; port CLK_1
SPI5_MISO: IC3.6(MISO) ; port MISO_3
SPI5_MOSI: IC3.5(SDA/MOSI) ; port MOSI_3
SPI5_SCK: IC3.3(SCL/SCLK) ; port CLK_3
SPI6_MISO: IC2.1(SDO) ; port MISO_2
SPI6_MOSI: IC2.14(SDI) ; port MOSI_2
SPI6_SCK: IC2.13(SCKL) ; port CLK_2
NetC4_2: C4.2 IC1.14(REGOUT)
NetIC1_5: IC1.5(CS) R1.1 ; port CS_1
NetIC1_6: IC1.6(INT) ; port INT1
NetIC1_8: IC1.8(FSYNC) IC2.9(FSYNC) IC3.7(INT/TRG) ; port FSYNC
NetIC2_4: IC2.4(INT1) ; port INT2
NetIC2_12: IC2.12(CS) ; port CS_2
NetIC3_1: IC3.1(INT) ; port INT3
NetIC3_2: IC3.2(MS/CS) ; port CS_3

### Library data of the parts
C1 C8 C10 = Cap0805: Voltage: 35V
C2 C7 C11 = Cap0603: Voltage: 50V
C3-C6 C9 C12 C13 = Cap0402: Voltage: 50V
IC1 = ICM-20602: Integrated Circuit; Manufacturer_Name: TDK; Datasheet Link: https://3cfeqx1hf82y3xcoull08ihx-wpengine.netdna-ssl.com/wp-content/uploads/2021/03/DS-000135-ICG-20660-TYP-v1.2.pdf; Manufacturer_Part_Number: ICM-20602; Mouser Part Number: 410-ICM-20602; Mouser Price/Stock: https://www.mouser.co.uk/ProductDetail/TDK-InvenSense/ICM-20602?qs=u4fy%2FsgLU9NtDChFbqTxBA%3D%3D; Arrow Part Number: ICM-20602; Arrow Price/Stock: https://www.arrow.com/en/products/icm-20602/invensense?utm_currency=USD&region=nac
IC2 = ICM-42688-P: Integrated Circuit; Manufacturer_Name: TDK; Datasheet Link: https://3cfeqx1hf82y3xcoull08ihx-wpengine.netdna-ssl.com/wp-content/uploads/2021/06/DS-000347-ICM-42688-P-v1.5.pdf; Manufacturer_Part_Number: ICM-42688-P; Mouser Part Number: 410-ICM-42688-P; Mouser Price/Stock: https://www.mouser.co.uk/ProductDetail/TDK-InvenSense/ICM-42688-P?qs=OlC7AqGiEDk8QrNAV728zw%3D%3D; Arrow Part Number: ICM-42688-P; Arrow Price/Stock: https://www.arrow.com/en/products/icm-42688-p/invensense?utm_currency=USD&region=nac
IC3 = MLX90393ELW-ABA-013-SP: Integrated Circuit; Manufacturer_Name: Melexis; Datasheet Link: https://www.melexis.com/-/media/files/documents/datasheets/mlx90393-datasheet-melexis.pdf; Height: 1mm; Manufacturer_Part_Number: MLX90393ELW-ABA-013-SP; Mouser Part Number: 482-90393ELWABA013SP; Mouser Price/Stock: https://www.mouser.co.uk/ProductDetail/Melexis/MLX90393ELW-ABA-013-SP?qs=4pzlT8jjbhe5W8hWOSw65g%3D%3D; Arrow Part Number: MLX90393ELW-ABA-013-SP; Arrow Price/Stock: https://www.arrow.com/en/products/mlx90393elw-aba-013-sp/melexis?utm_currency=USD&region=nac

## Sheet RF.SchDoc
size A4; SheetNumber: 5; SheetTotal: 11
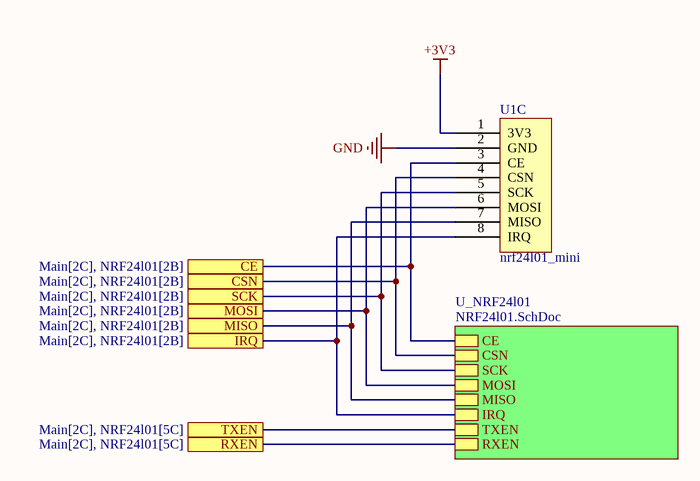
[diagram p5: RF.SchDoc]

### Parts
U1  nrf24l01_mini  [nr24l01_mini]  (part C of 3)

### Sub-sheets
U_NRF24l01 = NRF24l01.SchDoc: CE, CSN, SCK, MOSI, MISO, IRQ, TXEN, RXEN

### Ports
CE (see Main[2C], NRF24l01[2B]), CSN (see Main[2C], NRF24l01[2B]), IRQ (see Main[2C], NRF24l01[2B]), MISO (see Main[2C], NRF24l01[2B]), MOSI (see Main[2C], NRF24l01[2B]), RXEN (see Main[2C], NRF24l01[5C]), SCK (see Main[2C], NRF24l01[2B]), TXEN (see Main[2C], NRF24l01[5C])

### Nets
+3V3: U1.1(3V3)
GND: U1.2(GND)
NetIC4_110: U1.3(CE) ; port CE, sheet U_NRF24l01/CE
NetIC4_111: U1.5(SCK) ; port SCK, sheet U_NRF24l01/SCK
NetIC4_112: U1.7(MISO) ; port MISO, sheet U_NRF24l01/MISO
NetIC4_113: U1.6(MOSI) ; port MOSI, sheet U_NRF24l01/MOSI
NetIC4_114: U1.4(CSN) ; port CSN, sheet U_NRF24l01/CSN
NetIC4_115: U1.8(IRQ) ; port IRQ, sheet U_NRF24l01/IRQ
NetIC4_116: port TXEN, sheet U_NRF24l01/TXEN
NetIC4_117: port RXEN, sheet U_NRF24l01/RXEN

## Sheet NRF24l01.SchDoc
size A2; SheetNumber: 5; SheetTotal: 12
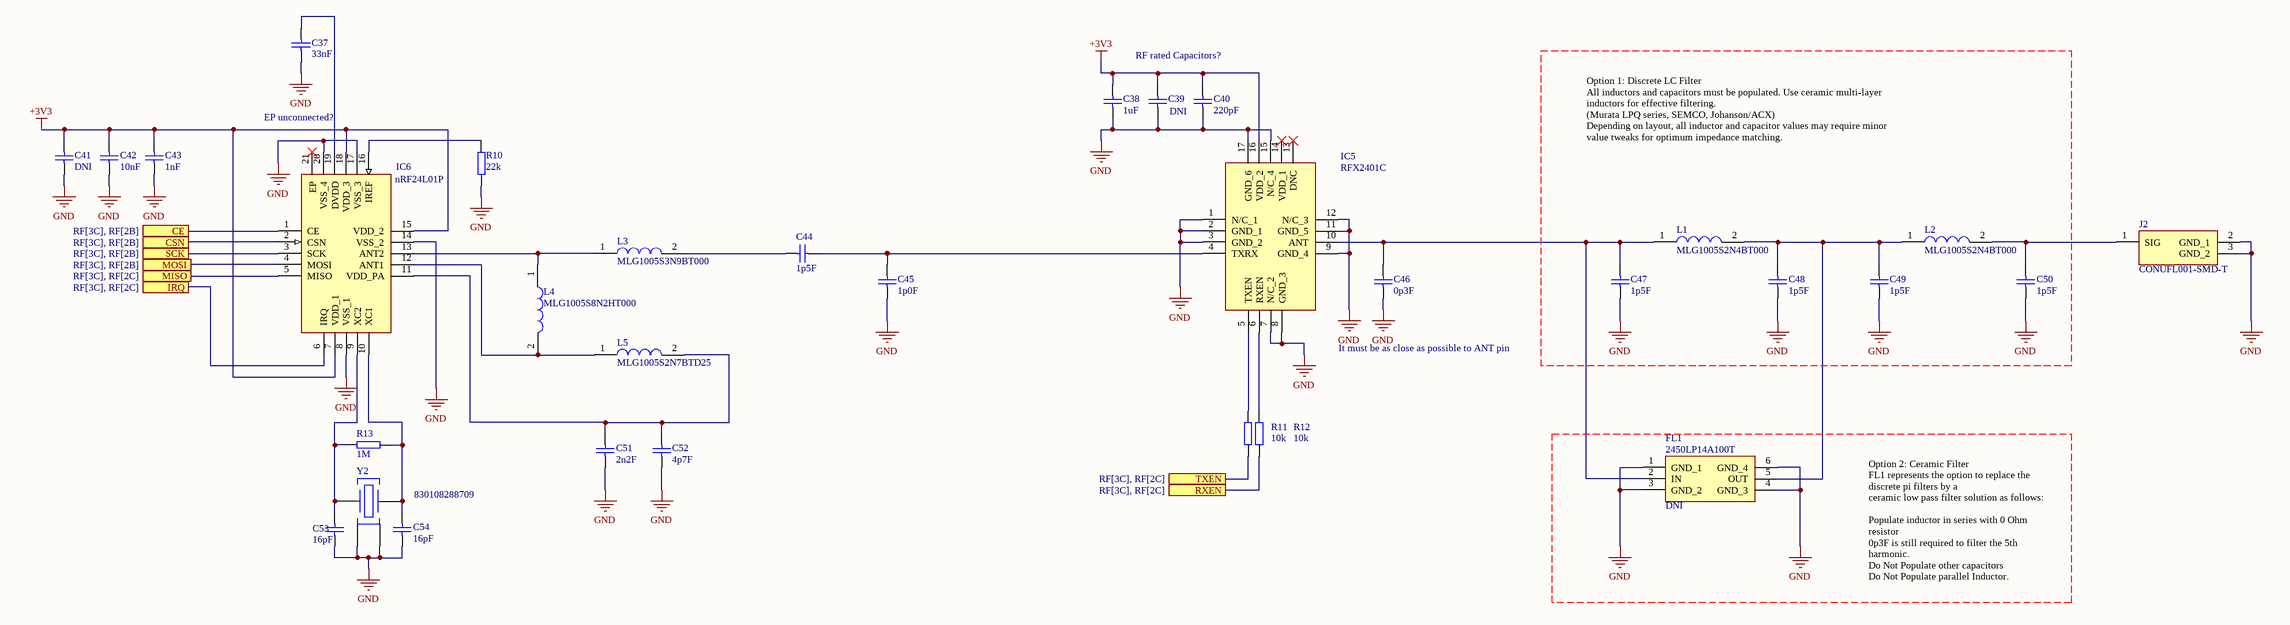
[diagram p6: NRF24l01.SchDoc]

### Parts
C37  value 33nF  [CAP0402]  (hidden comment: Cap0402)
C38  value 1uF  [CAP0402]  (hidden comment: Cap0402)
C39  value DNI  [CAP0402]  (hidden comment: Cap0402)
C40  value 220pF  [CAP0402]  (hidden comment: Cap0402)
C41  value DNI  [CAP0402]  (hidden comment: Cap0402)
C42  value 10nF  [CAP0402]  (hidden comment: Cap0402)
C43  value 1nF  [CAP0402]  (hidden comment: Cap0402)
C44  value 1p5F  [CAP0402]  (hidden comment: Cap0402)
C45  value 1p0F  [CAP0402]  (hidden comment: Cap0402)
C46  value 0p3F  [CAP0402]  (hidden comment: Cap0402)
C47  value 1p5F  [CAP0402]  (hidden comment: Cap0402)
C48  value 1p5F  [CAP0402]  (hidden comment: Cap0402)
C49  value 1p5F  [CAP0402]  (hidden comment: Cap0402)
C50  value 1p5F  [CAP0402]  (hidden comment: Cap0402)
C51  value 2n2F  [CAP0402]  (hidden comment: Cap0402)
C52  value 4p7F  [CAP0402]  (hidden comment: Cap0402)
C53  value 16pF  [CAP0402]  (hidden comment: Cap0402)
C54  value 16pF  [CAP0402]  (hidden comment: Cap0402)
FL1  2450LP14A100T  value DNI  [2450LP14A100T]
IC5  RFX2401C  [QFN50P300X300X60-17N-D]
IC6  nRF24L01P  [QFN50P400X400X95-21N-D]
J2  CONUFL001-SMD-T  [CONUFL001-SMD]
L1  MLG1005S2N4BT000  [MLG1005]
L2  MLG1005S2N4BT000  [MLG1005]
L3  MLG1005S3N9BT000  [MLG1005]
L4  MLG1005S8N2HT000  [MLG1005]
L5  MLG1005S2N7BTD25  [MLG1005]
R10  value 22k  [RES0402]  (hidden comment: Res0402)
R11  value 10k  [RES0402]  (hidden comment: Res0402)
R12  value 10k  [RES0402]  (hidden comment: Res0402)
R13  value 1M  [RES0402]  (hidden comment: Res0402)
Y2  830108288709  [830108288709]

### Ports
CE (see RF[3C], RF[2B]), CSN (see RF[3C], RF[2B]), IRQ (see RF[3C], RF[2C]), MISO (see RF[3C], RF[2C]), MOSI (see RF[3C], RF[2B]), RXEN (see RF[3C], RF[2C]), SCK (see RF[3C], RF[2B]), TXEN (see RF[3C], RF[2C])

### Nets
+3V3: C38.2 C39.2 C40.2 C41.2 C42.2 C43.2 IC5.16(VDD_2) IC6.7(VDD_1) IC6.15(VDD_2) IC6.18(VDD_3)
GND: C37.1 C38.1 C39.1 C40.1 C41.1 C42.1 C43.1 C45.1 C46.1 C47.1 C48.1 C49.1 C50.1 C51.1 C52.1 C53.1 C54.1 FL1.1(GND_1) FL1.3(GND_2) FL1.4(GND_3) FL1.6(GND_4) IC5.1(N/C_1) IC5.2(GND_1) IC5.3(GND_2) IC5.7(N/C_2) IC5.8(GND_3) IC5.9(GND_4) IC5.11(GND_5) IC5.12(N/C_3) IC5.15(N/C_4) IC5.17(GND_6) IC6.8(VSS_1) IC6.14(VSS_2) IC6.17(VSS_3) IC6.20(VSS_4) J2.2(GND_1) J2.3(GND_2) R10.1 Y2.2(GND_1) Y2.4(GND_2)
NetC37_2: C37.2 IC6.19(DVDD)
NetC44_1: C44.1 C45.2 IC5.4(TXRX)
NetC44_2: C44.2 L3.2
NetC46_2: C46.2 C47.2 FL1.2(IN) IC5.10(ANT) L1.1
NetC48_2: C48.2 C49.2 FL1.5(OUT) L1.2 L2.1
NetC50_2: C50.2 J2.1(SIG) L2.2
NetC51_2: C51.2 C52.2 IC6.11(VDD_PA) L5.2
NetC53_2: C53.2 IC6.9(XC2) R13.1 Y2.1(CRYSTAL_1)
NetC54_2: C54.2 IC6.10(XC1) R13.2 Y2.3(CRYSTAL_2)
NetIC4_110: IC6.1(CE) ; port CE
NetIC4_111: IC6.3(SCK) ; port SCK
NetIC4_112: IC6.5(MISO) ; port MISO
NetIC4_113: IC6.4(MOSI) ; port MOSI
NetIC4_114: IC6.2(CSN) ; port CSN
NetIC4_115: IC6.6(IRQ) ; port IRQ
NetIC4_116: R11.1 ; port TXEN
NetIC4_117: R12.1 ; port RXEN
NetIC5_5: IC5.5(TXEN) R11.2
NetIC5_6: IC5.6(RXEN) R12.2
NetIC6_12: IC6.12(ANT1) L4.2 L5.1
NetIC6_13: IC6.13(ANT2) L3.1 L4.1
NetIC6_16: IC6.16(IREF) R10.2

Not connected (* = marked no-connect by the designer): IC5 13(DNC)* 14(VDD_1)*; IC6 21(EP)*

### Notes on the sheet
- RF rated Capacitors?
- EP unconnected?
- Option 1: Discrete LC Filter
  All inductors and capacitors must be populated. Use ceramic multi-layer
  inductors for effective filtering.
  (Murata LPQ series, SEMCO, Johanson/ACX)
  Depending on layout, all inductor and capacitor values may require minor
  value tweaks for optimum impedance matching.
- It must be as close as possible to ANT pin
- Type @ to refer to a designator
- Option 2: Ceramic Filter
  FL1 represents the option to replace the discrete pi filters by a
  ceramic low pass filter solution as follows:
  Populate inductor in series with 0 Ohm resistor
  0p3F is still required to filter the 5th harmonic.
  Do Not Populate other capacitors
  Do Not Populate parallel Inductor.

### Library data of the parts
C37-C43 = Cap0402: Voltage: 6V3
C44-C52 = Cap0402: RF NP0; Voltage: 6V3
C53 C54 = Cap0402: NP0; Voltage: 6V3
FL1 = 2450LP14A100T: Filter; Manufacturer_Name: JOHANSON TECHNOLOGY; Datasheet Link: https://componentsearchengine.com/Datasheets/1/2450LP14A100T.pdf; Height: 0.7mm; Manufacturer_Part_Number: 2450LP14A100T; Arrow Part Number: 2450LP14A100T; Arrow Price/Stock: https://www.arrow.com/en/products/2450lp14a100t/johanson-dielectrics?region=nac
IC5 = RFX2401C: Integrated Circuit; Manufacturer_Name: Skyworks; Datasheet Link: https://eu.mouser.com/datasheet/2/472/RFX2401C_204359B-1524606.pdf; Height: 0.6mm; Manufacturer_Part_Number: RFX2401C; Arrow Part Number: RFX2401C; Arrow Price/Stock: https://www.arrow.com/en/products/rfx2401c/skyworks-solutions?region=nac
IC6 = nRF24L01P: Integrated Circuit; Manufacturer_Name: Nordic Semiconductor; Height: 0.95mm; Manufacturer_Part_Number: nRF24L01P
J2 = CONUFL001-SMD-T: Connector; Manufacturer_Name: Linx Technologies; Datasheet Link: https://linxtechnologies.com/wp/product/mhf-rf-connectors/; Manufacturer_Part_Number: CONUFL001-SMD-T; Mouser Part Number: 712-CONUFL001-SMD-T; Mouser Price/Stock: https://www.mouser.co.uk/ProductDetail/Linx-Technologies/CONUFL001-SMD-T?qs=EU6FO9ffTwfRdkBeQTdJWQ%3D%3D
L1 L2 = MLG1005S2N4BT000: Inductor; Manufacturer_Name: TDK; Datasheet Link: https://product.tdk.com/system/files/dam/doc/product/inductor/inductor/smd/catalog/inductor_commercial_high-frequency_mlg1005s_en.pdf; Manufacturer_Part_Number: MLG1005S2N4BT000; Arrow Part Number: MLG1005S2N4BT000; Arrow Price/Stock: https://www.arrow.com/en/products/mlg1005s2n4bt000/tdk
L3 = MLG1005S3N9BT000: Inductor; Manufacturer_Name: TDK; Datasheet Link: https://product.tdk.com/system/files/dam/doc/product/inductor/inductor/smd/catalog/inductor_commercial_high-frequency_mlg1005s_en.pdf; Manufacturer_Part_Number: MLG1005S3N9BT000; Arrow Part Number: MLG1005S3N9BT000; Arrow Price/Stock: https://www.arrow.com/en/products/mlg1005s3n9bt000/tdk
L4 = MLG1005S8N2HT000: Inductor; Manufacturer_Name: TDK; Datasheet Link: https://product.tdk.com/system/files/dam/doc/product/inductor/inductor/smd/catalog/inductor_commercial_high-frequency_mlg1005s_en.pdf; Manufacturer_Part_Number: MLG1005S8N2HT000
L5 = MLG1005S2N7BTD25: Inductor; Manufacturer_Name: TDK; Datasheet Link: https://product.tdk.com/system/files/dam/doc/product/inductor/inductor/smd/catalog/inductor_automotive_high-frequency_mlg1005s_en.pdf; Manufacturer_Part_Number: MLG1005S2N7BTD25
Y2 = 830108288709: Crystal or Oscillator; Manufacturer_Name: Wurth Elektronik; Datasheet Link: https://www.we-online.com/catalog/datasheet/830108340709.pdf; Height: 0.5mm; Manufacturer_Part_Number: 830108288709

## Sheet Flash.SchDoc
size A4; SheetNumber: 8; SheetTotal: 11
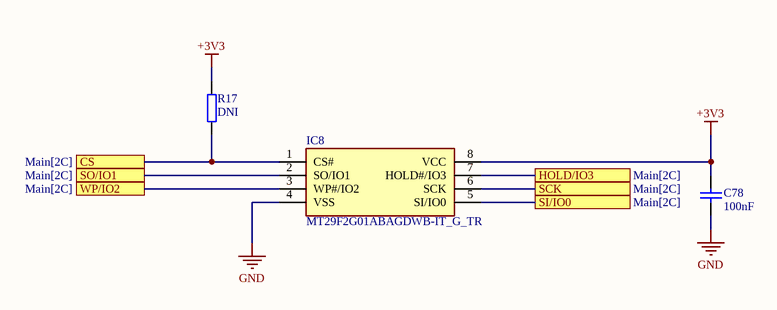
[diagram p7: Flash.SchDoc]

### Parts
(Parts that share a designator on the sheet are numbered #1, #2 ... from top to bottom, then left to right.)
C78#1  value 100nF  [CAP0402]  (hidden comment: Cap0402)
IC8  MT29F2G01ABAGDWB-IT_G_TR  [SON127P800X600X65-8N]
R17#1  value DNI  [RES0402]  (hidden comment: Res0402)

### Ports
CS (see Main[2C]), HOLD/IO3 (see Main[2C]), SCK (see Main[2C]), SI/IO0 (see Main[2C]), SO/IO1 (see Main[2C]), WP/IO2 (see Main[2C])

### Nets
+3V3: C78#1.2 IC8.8(VCC) R17#1.2
GND: C78#1.1 IC8.4(VSS)
NetIC4_42: IC8.7(HOLD#/IO3) ; port HOLD/IO3
NetIC4_43: IC8.3(WP#/IO2) ; port WP/IO2
NetIC4_46: IC8.2(SO/IO1) ; port SO/IO1
NetIC4_47: IC8.5(SI/IO0) ; port SI/IO0
NetIC4_48: IC8.6(SCK) ; port SCK
NetIC4_64: IC8.1(CS#) R17#1.1 ; port CS

### Library data of the parts
C78#1 = Cap0402: Voltage: 50V
IC8 = MT29F2G01ABAGDWB-IT_G_TR: Integrated Circuit; Manufacturer_Name: Micron; Manufacturer_Part_Number: MT29F2G01ABAGDWB-IT:G TR; Datasheet Link: https://www.arrow.com/en/products/mt29f2g01abagdwb-itgtr/micron-technology; Height: 0.65mm; Mouser Part Number: 340-319922-REEL; Mouser Price/Stock: https://www.mouser.co.uk/ProductDetail/Micron/MT29F2G01ABAGDWB-ITG-TR?qs=j%252B1pi9TdxUa99FyONPZPSg%3D%3D; Arrow Part Number: MT29F2G01ABAGDWB-IT:G TR; Arrow Price/Stock: https://www.arrow.com/en/products/mt29f2g01abagdwb-itg-tr/micron-technology?region=nac

## Sheet GPS.SchDoc
size A4; SheetNumber: 8; SheetTotal: 12
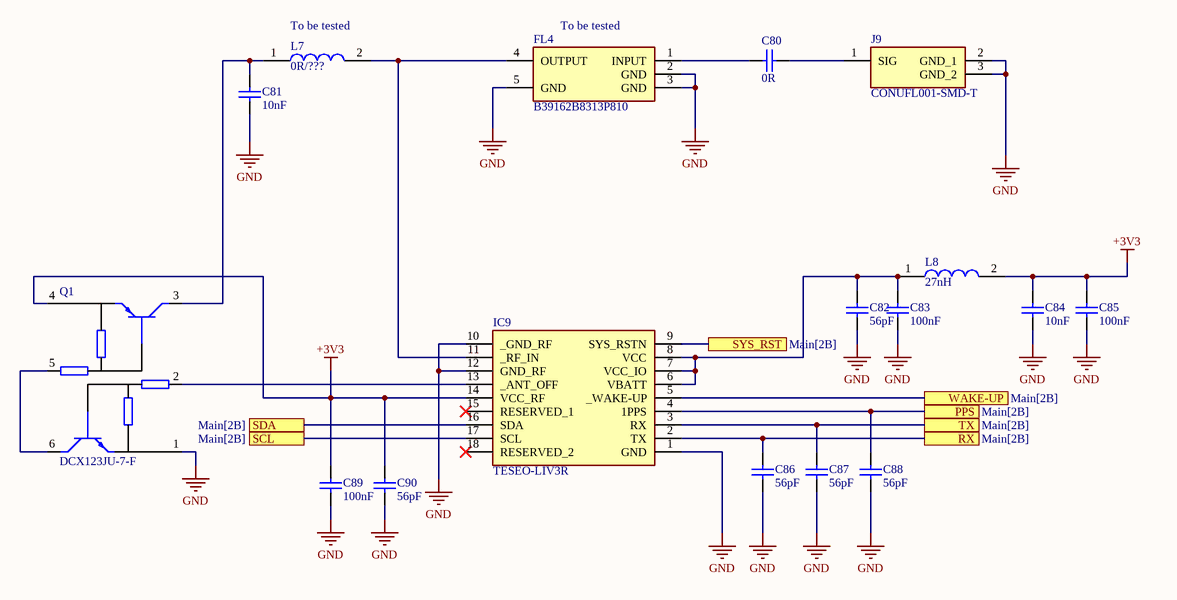
[diagram p8: GPS.SchDoc]

### Parts
C80  value 0R  [CAP0402]  (hidden comment: Cap0402)
C81  value 10nF  [CAP0402]  (hidden comment: Cap0402)
C82  value 56pF  [CAP0402]  (hidden comment: Cap0402)
C83  value 100nF  [CAP0402]  (hidden comment: Cap0402)
C84  value 10nF  [CAP0402]  (hidden comment: Cap0402)
C85  value 100nF  [CAP0402]  (hidden comment: Cap0402)
C86  value 56pF  [CAP0402]  (hidden comment: Cap0402)
C87  value 56pF  [CAP0402]  (hidden comment: Cap0402)
C88  value 56pF  [CAP0402]  (hidden comment: Cap0402)
C89  value 100nF  [CAP0402]  (hidden comment: Cap0402)
C90  value 56pF  [CAP0402]  (hidden comment: Cap0402)
FL4  B39162B8313P810  [B39162B8313P810]
IC9  TESEO-LIV3R  [TESEOLIV3R]
J9  CONUFL001-SMD-T  [CONUFL001-SMD]
L7  value 0R/???  [INDC1005X55N]  (hidden comment: LQG15HS27NJ02)
L8  value 27nH  [INDC1005X55N]  (hidden comment: LQG15HS27NJ02)
Q1  DCX123JU-7-F  [SOT65P210X110-6N]

### Ports
PPS (see Main[2B]), RX (see Main[2B]), SCL (see Main[2B]), SDA (see Main[2B]), SYS_RST (see Main[2B]), TX (see Main[2B]), WAKE-UP (see Main[2B])

### Nets
+3V3: C84.2 C85.2 C89.2 C90.2 IC9.14(VCC_RF) L8.2 Q1.4(E)
GND: C81.1 C82.1 C83.1 C84.1 C85.1 C86.1 C87.1 C88.1 C89.1 C90.1 FL4.2(GND) FL4.3(GND) FL4.5(GND) IC9.1(GND) IC9.10(_GND_RF) IC9.12(GND_RF) J9.2(GND_1) J9.3(GND_2) Q1.1(E)
NetC80_1: C80.1 J9.1(SIG)
NetC80_2: C80.2 FL4.1(INPUT)
NetC81_2: C81.2 L7.1 Q1.3(C)
NetC82_2: C82.2 C83.2 IC9.6(VBATT) IC9.7(VCC_IO) IC9.8(VCC) L8.1
NetC86_2: C86.2 IC9.2(TX) ; port RX
NetC87_2: C87.2 IC9.3(RX) ; port TX
NetC88_2: C88.2 IC9.4(1PPS) ; port PPS
NetFL4_4: FL4.4(OUTPUT) IC9.11(_RF_IN) L7.2
NetIC4_91: IC9.9(SYS_RSTN) ; port SYS_RST
NetIC4_100: IC9.5(_WAKE-UP) ; port WAKE-UP
NetIC9_13: IC9.13(_ANT_OFF) Q1.2(B)
NetIC9_16: IC9.16(SDA) ; port SDA
NetIC9_17: IC9.17(SCL) ; port SCL
NetQ1_5: Q1.5(B) Q1.6(C)

Not connected (* = marked no-connect by the designer): IC9 15(RESERVED_1)* 18(RESERVED_2)*

### Notes on the sheet
- (near L7) To be tested
- (near FL4) To be tested

### Library data of the parts
C80 = Cap0402: RF NP0
C81 = Cap0402: RF NP0; Voltage: 50V
C82-C90 = Cap0402: Voltage: 50V
FL4 = B39162B8313P810: Filter; Manufacturer_Name: RF360; Datasheet Link: https://4donline.ihs.com/images/VipMasterIC/IC/TDKC/TDKC-S-A0001073526/TDKC-S-A0001073105-1.pdf?hkey=52A5661711E402568146F3353EA87419; Height: 0.4mm; Manufacturer_Part_Number: B39162B8313P810; Mouser Part Number: N/A; Mouser Price/Stock: https://www.mouser.co.uk/ProductDetail/RF360/B39162B8313P810?qs=%2Fd%252BFzHvH4c20Rngavm5AuA%3D%3D
IC9 = TESEO-LIV3R: Integrated Circuit; Manufacturer_Name: STMicroelectronics; Datasheet Link: https://www.st.com/resource/en/datasheet/teseo-liv3r.pdf; Height: 2.3mm; Manufacturer_Part_Number: TESEO-LIV3R; Mouser Part Number: 511-TESEO-LIV3R; Mouser Price/Stock: https://www.mouser.co.uk/ProductDetail/STMicroelectronics/TESEO-LIV3R?qs=ZSypp649SOXG7EmhCFcBlw%3D%3D; Arrow Part Number: TESEO-LIV3R; Arrow Price/Stock: https://www.arrow.com/en/products/teseo-liv3r/stmicroelectronics?region=nac
J9 = CONUFL001-SMD-T: as J2 on sheet NRF24l01; Datasheet Link: https://linxtechnologies.com/wp/product/mhf-rf-connectors/; Manufacturer_Part_Number: CONUFL001-SMD-T; Mouser Part Number: 712-CONUFL001-SMD-T; Mouser Price/Stock: https://www.mouser.co.uk/ProductDetail/Linx-Technologies/CONUFL001-SMD-T?qs=EU6FO9ffTwfRdkBeQTdJWQ%3D%3D
L7 L8 = LQG15HS27NJ02: Inductor
Q1 = DCX123JU-7-F: Transistor BJT PNP; Manufacturer_Name: Diodes Incorporated; Datasheet Link: https://www.diodes.com//assets/Datasheets/DCX_XXXX_U.pdf; Height: 1.1mm; Manufacturer_Part_Number: DCX123JU-7-F; Mouser Part Number: 621-DCX123JU-F; Mouser Price/Stock: https://www.mouser.co.uk/ProductDetail/Diodes-Incorporated/DCX123JU-7-F?qs=JodRp68BO%2F64PTlIzh5LEQ%3D%3D; Arrow Part Number: DCX123JU-7-F; Arrow Price/Stock: https://www.arrow.com/en/products/dcx123ju-7-f/diodes-incorporated

## Sheet Barometer.SchDoc
size A4; SheetNumber: 9; SheetTotal: 12
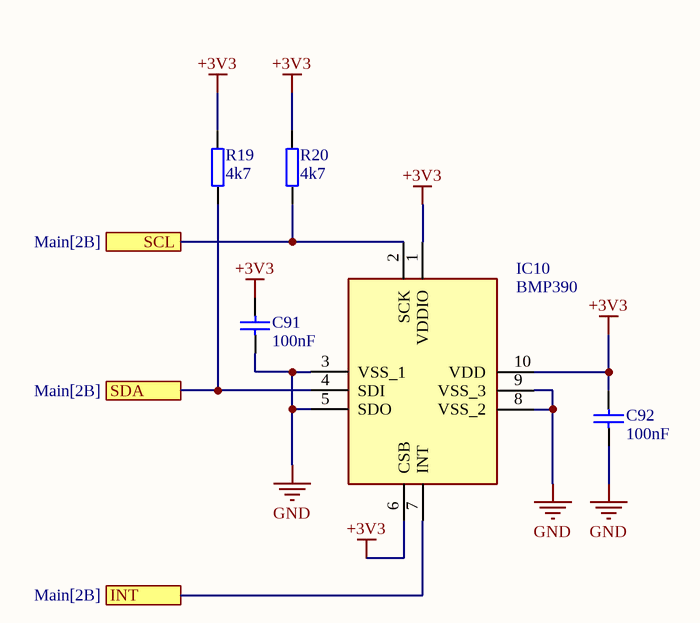
[diagram p9: Barometer.SchDoc]

### Parts
(Parts that share a designator on the sheet are numbered #1, #2 ... from top to bottom, then left to right.)
C91  value 100nF  [CAP0402]  (hidden comment: Cap0402)
C92#1  value 100nF  [CAP0402]  (hidden comment: Cap0402)
IC10  BMP390  [BMP390]
R19  value 4k7  [RES0402]  (hidden comment: Res0402)
R20#1  value 4k7  [RES0402]  (hidden comment: Res0402)

### Ports
INT (see Main[2B]), SCL (see Main[2B]), SDA (see Main[2B])

### Nets
+3V3: C91.2 C92#1.2 IC10.1(VDDIO) IC10.6(CSB) IC10.10(VDD) R19.2 R20#1.2
GND: C91.1 C92#1.1 IC10.3(VSS_1) IC10.5(SDO) IC10.8(VSS_2) IC10.9(VSS_3)
NetIC4_53: IC10.7(INT) ; port INT
NetIC4_54: IC10.2(SCK) R20#1.1 ; port SCL
NetIC4_55: IC10.4(SDI) R19.1 ; port SDA

### Library data of the parts
C91 C92#1 = Cap0402: Voltage: 50V
IC10 = BMP390: Integrated Circuit; Manufacturer_Name: BOSCH; Datasheet Link: https://www.bosch-sensortec.com/media/boschsensortec/downloads/datasheets/bst-bmp390-ds002.pdf; Height: 0.8mm; Manufacturer_Part_Number: BMP390; Mouser Part Number: 262-BMP390; Mouser Price/Stock: https://www.mouser.co.uk/ProductDetail/Bosch-Sensortec/BMP390?qs=QNEnbhJQKvYQVfvRMgo2YA%3D%3D; Arrow Part Number: BMP390; Arrow Price/Stock: https://www.arrow.com/en/products/bmp390/bosch?region=nac

## Sheet LED.SchDoc
size A4; SheetNumber: 11; SheetTotal: 11
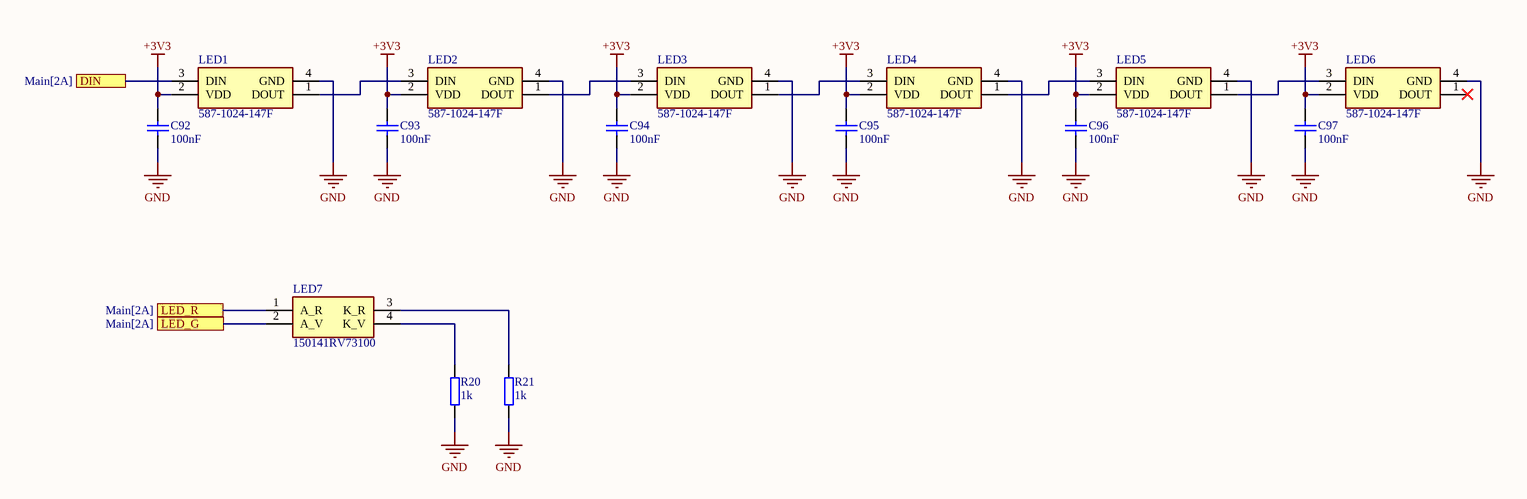
[diagram p10: LED.SchDoc]

### Parts
(Parts that share a designator on the sheet are numbered #1, #2 ... from top to bottom, then left to right.)
C92#2  value 100nF  [CAP0402]  (hidden comment: Cap0402)
C93  value 100nF  [CAP0402]  (hidden comment: Cap0402)
C94  value 100nF  [CAP0402]  (hidden comment: Cap0402)
C95  value 100nF  [CAP0402]  (hidden comment: Cap0402)
C96  value 100nF  [CAP0402]  (hidden comment: Cap0402)
C97  value 100nF  [CAP0402]  (hidden comment: Cap0402)
LED1  587-1024-147F  [5871024147F]
LED2  587-1024-147F  [5871024147F]
LED3  587-1024-147F  [5871024147F]
LED4  587-1024-147F  [5871024147F]
LED5  587-1024-147F  [5871024147F]
LED6  587-1024-147F  [5871024147F]
LED7  150141RV73100  [150141RV73100]
R20#2  value 1k  [RES0402]  (hidden comment: Res0402)
R21  value 1k  [RES0402]  (hidden comment: Res0402)

### Ports
DIN (see Main[2A]), LED_G (see Main[2A]), LED_R (see Main[2A])

### Nets
+3V3: C92#2.2 C93.2 C94.2 C95.2 C96.2 C97.2 LED1.2(VDD) LED2.2(VDD) LED3.2(VDD) LED4.2(VDD) LED5.2(VDD) LED6.2(VDD)
GND: C92#2.1 C93.1 C94.1 C95.1 C96.1 C97.1 LED1.4(GND) LED2.4(GND) LED3.4(GND) LED4.4(GND) LED5.4(GND) LED6.4(GND) R20#2.1 R21.1
NetIC4_5: LED1.3(DIN) ; port DIN
NetIC4_26: LED7.2(A_V) ; port LED_G
NetIC4_27: LED7.1(A_R) ; port LED_R
NetLED1_1: LED1.1(DOUT) LED2.3(DIN)
NetLED2_1: LED2.1(DOUT) LED3.3(DIN)
NetLED3_1: LED3.1(DOUT) LED4.3(DIN)
NetLED4_1: LED4.1(DOUT) LED5.3(DIN)
NetLED5_1: LED5.1(DOUT) LED6.3(DIN)
NetLED7_3: LED7.3(K_R) R21.2
NetLED7_4: LED7.4(K_V) R20#2.2

Not connected (* = marked no-connect by the designer): LED6 1(DOUT)*

### Library data of the parts
C92#2 C93-C97 = Cap0402: Voltage: 50V
LED1-LED6 = 587-1024-147F: LED; Manufacturer_Name: Dialight; Datasheet Link: https://s3-us-west-2.amazonaws.com/catsy.557/Dialight_datasheet_587-1024-147F_Addressable_RGB.pdf; Height: 0.9mm; Manufacturer_Part_Number: 587-1024-147F
LED7 = 150141RV73100: LED (Multiple); Manufacturer_Name: Wurth Elektronik; Datasheet Link: https://www.we-online.com/components/products/datasheet/150141RV73100.pdf; Height: 2.1mm; Manufacturer_Part_Number: 150141RV73100; Mouser Part Number: 710-150141RV73100; Mouser Price/Stock: https://www.mouser.co.uk/ProductDetail/Wurth-Elektronik/150141RV73100?qs=LlUlMxKIyB1w9QlMugtMLA%3D%3D

## Sheet PB_Conn.SchDoc
size A3; SheetNumber: 11; SheetTotal: 12
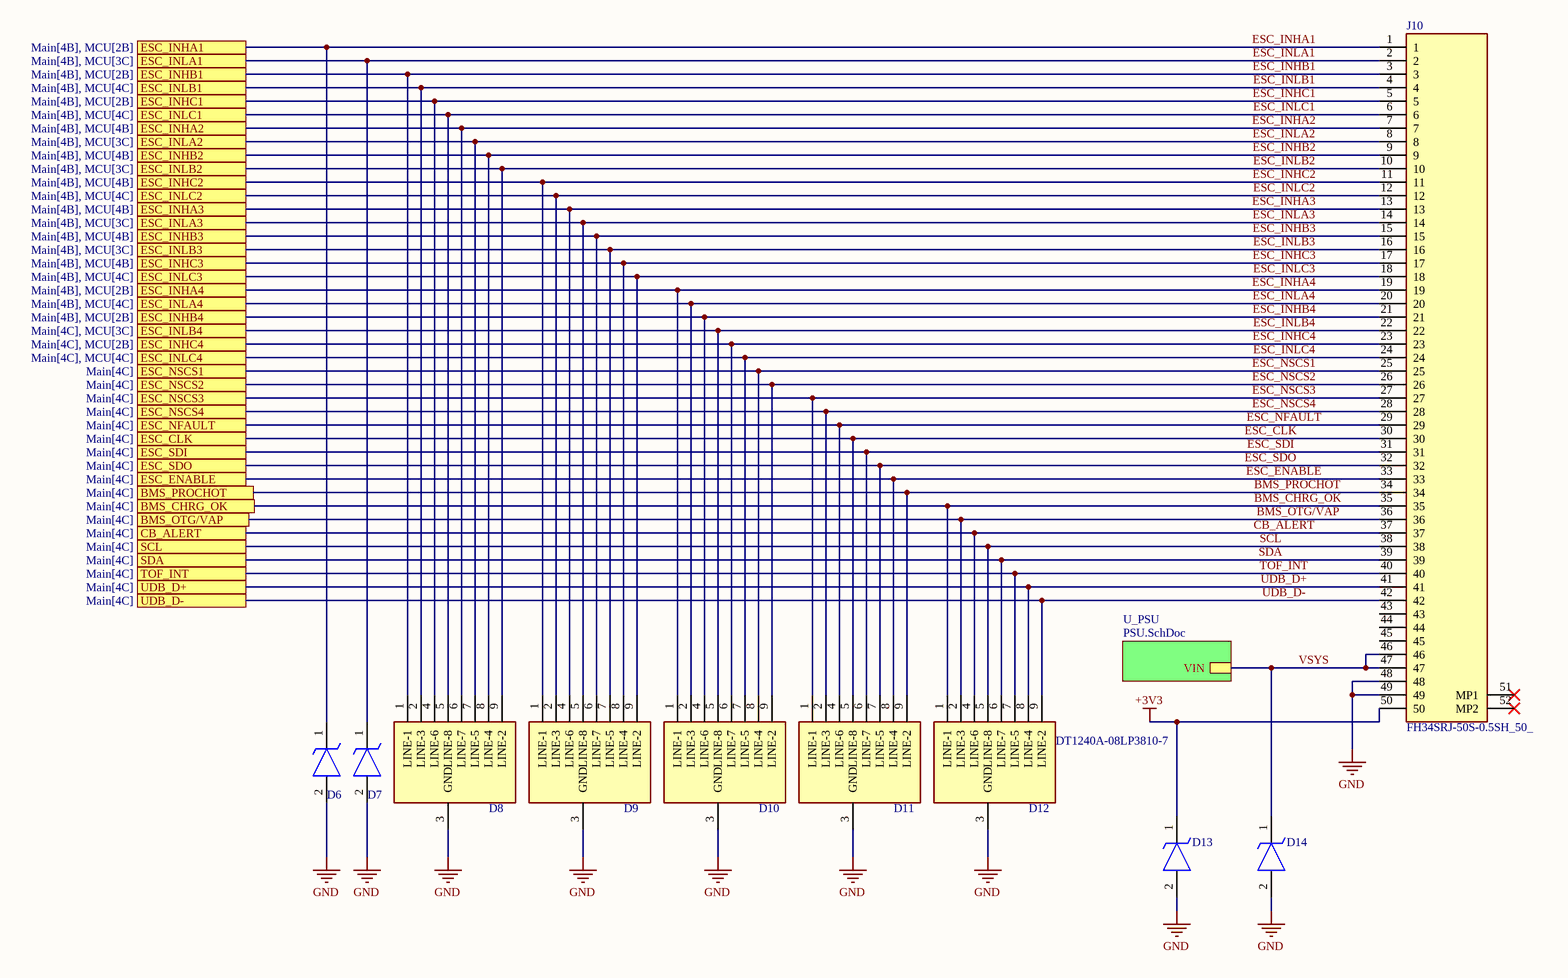
[diagram p11: PB_Conn.SchDoc]

### Parts
D6  D1213A-01LP4-7B  [D1213A01LP47B]  (value not drawn)
D7  D1213A-01LP4-7B  [D1213A01LP47B]  (value not drawn)
D8  DT1240A-08LP3810-7  [DT1240A08LP38107]  (value not drawn)
D9  DT1240A-08LP3810-7  [DT1240A08LP38107]  (value not drawn)
D10  DT1240A-08LP3810-7  [DT1240A08LP38107]  (value not drawn)
D11  DT1240A-08LP3810-7  [DT1240A08LP38107]  (value not drawn)
D12  DT1240A-08LP3810-7  [DT1240A08LP38107]
D13  DF2S24FS,L3M  [SODFL1006X45N]  (value not drawn)
D14  DF2S24FS,L3M  [SODFL1006X45N]  (value not drawn)
J10  FH34SRJ-50S-0.5SH_50_  [FH34SRJ50S05SH50]

### Sub-sheets
U_PSU = PSU.SchDoc: VIN

### Ports
BMS_CHRG_OK (see Main[4C]), BMS_OTG/VAP (see Main[4C]), BMS_PROCHOT (see Main[4C]), CB_ALERT (see Main[4C]), ESC_CLK (see Main[4C]), ESC_ENABLE (see Main[4C]), ESC_INHA1 (see Main[4B], MCU[2B]), ESC_INHA2 (see Main[4B], MCU[4B]), ESC_INHA3 (see Main[4B], MCU[4B]), ESC_INHA4 (see Main[4B], MCU[2B]), ESC_INHB1 (see Main[4B], MCU[2B]), ESC_INHB2 (see Main[4B], MCU[4B]), ESC_INHB3 (see Main[4B], MCU[4B]), ESC_INHB4 (see Main[4B], MCU[2B]), ESC_INHC1 (see Main[4B], MCU[2B]), ESC_INHC2 (see Main[4B], MCU[4B]), ESC_INHC3 (see Main[4B], MCU[4B]), ESC_INHC4 (see Main[4C], MCU[2B]), ESC_INLA1 (see Main[4B], MCU[3C]), ESC_INLA2 (see Main[4B], MCU[3C]), ESC_INLA3 (see Main[4B], MCU[3C]), ESC_INLA4 (see Main[4B], MCU[4C]), ESC_INLB1 (see Main[4B], MCU[4C]), ESC_INLB2 (see Main[4B], MCU[3C]), ESC_INLB3 (see Main[4B], MCU[3C]), ESC_INLB4 (see Main[4C], MCU[3C]), ESC_INLC1 (see Main[4B], MCU[4C]), ESC_INLC2 (see Main[4B], MCU[4C]), ESC_INLC3 (see Main[4B], MCU[4C]), ESC_INLC4 (see Main[4C], MCU[4C]), ESC_NFAULT (see Main[4C]), ESC_NSCS1 (see Main[4C]), ESC_NSCS2 (see Main[4C]), ESC_NSCS3 (see Main[4C]), ESC_NSCS4 (see Main[4C]), ESC_SDI (see Main[4C]), ESC_SDO (see Main[4C]), SCL (see Main[4C]), SDA (see Main[4C]), TOF_INT (see Main[4C]), UDB_D+ (see Main[4C]), UDB_D- (see Main[4C])

### Nets
+3V3: D13.1(K) J10.50
GND: D6.2(A) D7.2(A) D8.3(GND) D9.3(GND) D10.3(GND) D11.3(GND) D12.3(GND) D13.2(A) D14.2(A) J10.48 J10.49
BMS_CHRG_OK: D12.1(LINE-1) J10.35 ; port BMS_CHRG_OK
BMS_OTG/VAP: D12.2(LINE-3) J10.36 ; port BMS_OTG/VAP
BMS_PROCHOT: D11.9(LINE-2) J10.34 ; port BMS_PROCHOT
CB_ALERT: D12.4(LINE-6) J10.37 ; port CB_ALERT
ESC_CLK: D11.5(LINE-8) J10.30 ; port ESC_CLK
ESC_ENABLE: D11.8(LINE-4) J10.33 ; port ESC_ENABLE
ESC_INHA1: D6.1(K) J10.1 ; port ESC_INHA1
ESC_INHA2: D8.6(LINE-7) J10.7 ; port ESC_INHA2
ESC_INHA3: D9.4(LINE-6) J10.13 ; port ESC_INHA3
ESC_INHA4: D10.1(LINE-1) J10.19 ; port ESC_INHA4
ESC_INHB1: D8.1(LINE-1) J10.3 ; port ESC_INHB1
ESC_INHB2: D8.8(LINE-4) J10.9 ; port ESC_INHB2
ESC_INHB3: D9.6(LINE-7) J10.15 ; port ESC_INHB3
ESC_INHB4: D10.4(LINE-6) J10.21 ; port ESC_INHB4
ESC_INHC1: D8.4(LINE-6) J10.5 ; port ESC_INHC1
ESC_INHC2: D9.1(LINE-1) J10.11 ; port ESC_INHC2
ESC_INHC3: D9.8(LINE-4) J10.17 ; port ESC_INHC3
ESC_INHC4: D10.6(LINE-7) J10.23 ; port ESC_INHC4
ESC_INLA1: D7.1(K) J10.2 ; port ESC_INLA1
ESC_INLA2: D8.7(LINE-5) J10.8 ; port ESC_INLA2
ESC_INLA3: D9.5(LINE-8) J10.14 ; port ESC_INLA3
ESC_INLA4: D10.2(LINE-3) J10.20 ; port ESC_INLA4
ESC_INLB1: D8.2(LINE-3) J10.4 ; port ESC_INLB1
ESC_INLB2: D8.9(LINE-2) J10.10 ; port ESC_INLB2
ESC_INLB3: D9.7(LINE-5) J10.16 ; port ESC_INLB3
ESC_INLB4: D10.5(LINE-8) J10.22 ; port ESC_INLB4
ESC_INLC1: D8.5(LINE-8) J10.6 ; port ESC_INLC1
ESC_INLC2: D9.2(LINE-3) J10.12 ; port ESC_INLC2
ESC_INLC3: D9.9(LINE-2) J10.18 ; port ESC_INLC3
ESC_INLC4: D10.7(LINE-5) J10.24 ; port ESC_INLC4
ESC_NFAULT: D11.4(LINE-6) J10.29 ; port ESC_NFAULT
ESC_NSCS1: D10.8(LINE-4) J10.25 ; port ESC_NSCS1
ESC_NSCS2: D10.9(LINE-2) J10.26 ; port ESC_NSCS2
ESC_NSCS3: D11.1(LINE-1) J10.27 ; port ESC_NSCS3
ESC_NSCS4: D11.2(LINE-3) J10.28 ; port ESC_NSCS4
ESC_SDI: D11.6(LINE-7) J10.31 ; port ESC_SDI
ESC_SDO: D11.7(LINE-5) J10.32 ; port ESC_SDO
SCL: D12.5(LINE-8) J10.38 ; port SCL
SDA: D12.6(LINE-7) J10.39 ; port SDA
TOF_INT: D12.7(LINE-5) J10.40 ; port TOF_INT
UDB_D+: D12.8(LINE-4) J10.41 ; port UDB_D+
UDB_D-: D12.9(LINE-2) J10.42 ; port UDB_D-
VSYS: D14.1(K) J10.46 J10.47 ; sheet U_PSU/VIN

Not connected (* = marked no-connect by the designer): J10 43 44 45 51(MP1)* 52(MP2)*

### Library data of the parts
D6 D7 = D1213A-01LP4-7B: as D1 on sheet MCU; Datasheet Link: https://www.diodes.com/assets/Datasheets/D1213A-01LP4.pdf; Height: 0.4mm; Manufacturer_Part_Number: D1213A-01LP4-7B; Mouser Part Number: 621-D1213A-01LP4-7B; Mouser Price/Stock: https://www.mouser.co.uk/ProductDetail/Diodes-Incorporated/D1213A-01LP4-7B?qs=gfe7vQ8txpVKfG5NOSOvfA%3D%3D; Arrow Part Number: D1213A-01LP4-7B; Arrow Price/Stock: https://www.arrow.com/en/products/d1213a-01lp4-7b/diodes-incorporated?region=europe
D8-D12 = DT1240A-08LP3810-7: TVS Diode (Uni-directional); Manufacturer_Name: Diodes Incorporated; Datasheet Link: https://www.diodes.com//assets/Datasheets/DT1240A-08LP3810.pdf; Height: 0.55mm; Manufacturer_Part_Number: DT1240A-08LP3810-7; Mouser Part Number: 621-DT1240A08LP38107; Mouser Price/Stock: https://www.mouser.co.uk/ProductDetail/Diodes-Incorporated/DT1240A-08LP3810-7?qs=W0yvOO0ixfFwCalJyqXN4A%3D%3D; Arrow Part Number: DT1240A-08LP3810-7; Arrow Price/Stock: null?region=nac
D13 D14 = DF2S24FS,L3M: TVS Diode (Uni-directional); Manufacturer_Name: Toshiba; Datasheet Link: https://www.mouser.com/datasheet/2/408/DF2S24FS_datasheet_en_20140718-708374.pdf; Height: 0.45mm; Manufacturer_Part_Number: DF2S24FS,L3M; Mouser Part Number: 757-DF2S24FSL3M; Mouser Price/Stock: https://www.mouser.co.uk/ProductDetail/Toshiba/DF2S24FSL3M?qs=lhkzy8lC%252BSvG2umxl0FuEw%3D%3D; Arrow Part Number: DF2S24FS,L3M; Arrow Price/Stock: https://www.arrow.com/en/products/df2s24fsl3m/toshiba?region=nac
J10 = FH34SRJ-50S-0.5SH_50_: Connector; Manufacturer_Name: Hirose; Manufacturer_Part_Number: FH34SRJ-50S-0.5SH(50); Datasheet Link: https://www.hirose.com/en/product/document?clcode=CL0580-1266-2-50&productname=FH34SRJ-50S-0.5SH(50)&series=FH34SRJ&documenttype=2DDrawing&lang=en&documentid=0001483059; Height: 1.75mm; Mouser Part Number: 798-FH34SRJ50S05SH50; Mouser Price/Stock: https://www.mouser.co.uk/ProductDetail/Hirose-Connector/FH34SRJ-50S-0.5SH50?qs=vcbW%252B4%252BSTIrLLD%2F8H%2F%252B%2Fhg%3D%3D; System: Connector